# Altium project Gesturelink.PrjPcb (part 1 of 4)
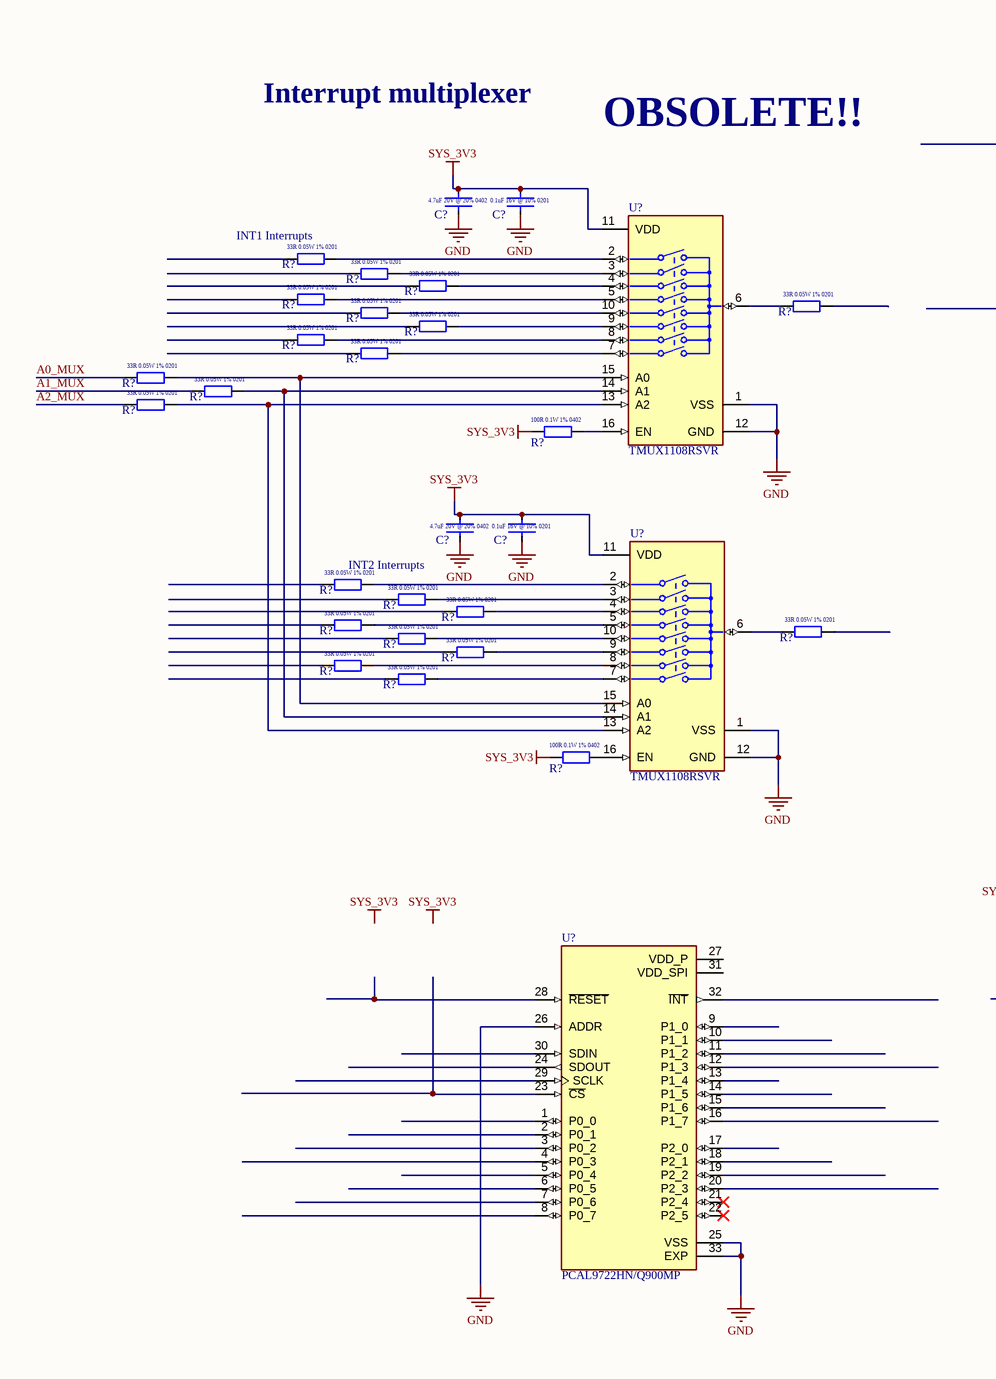
[diagram p0: Translate to rigid Flex gesture recognition.SchDoc, left]
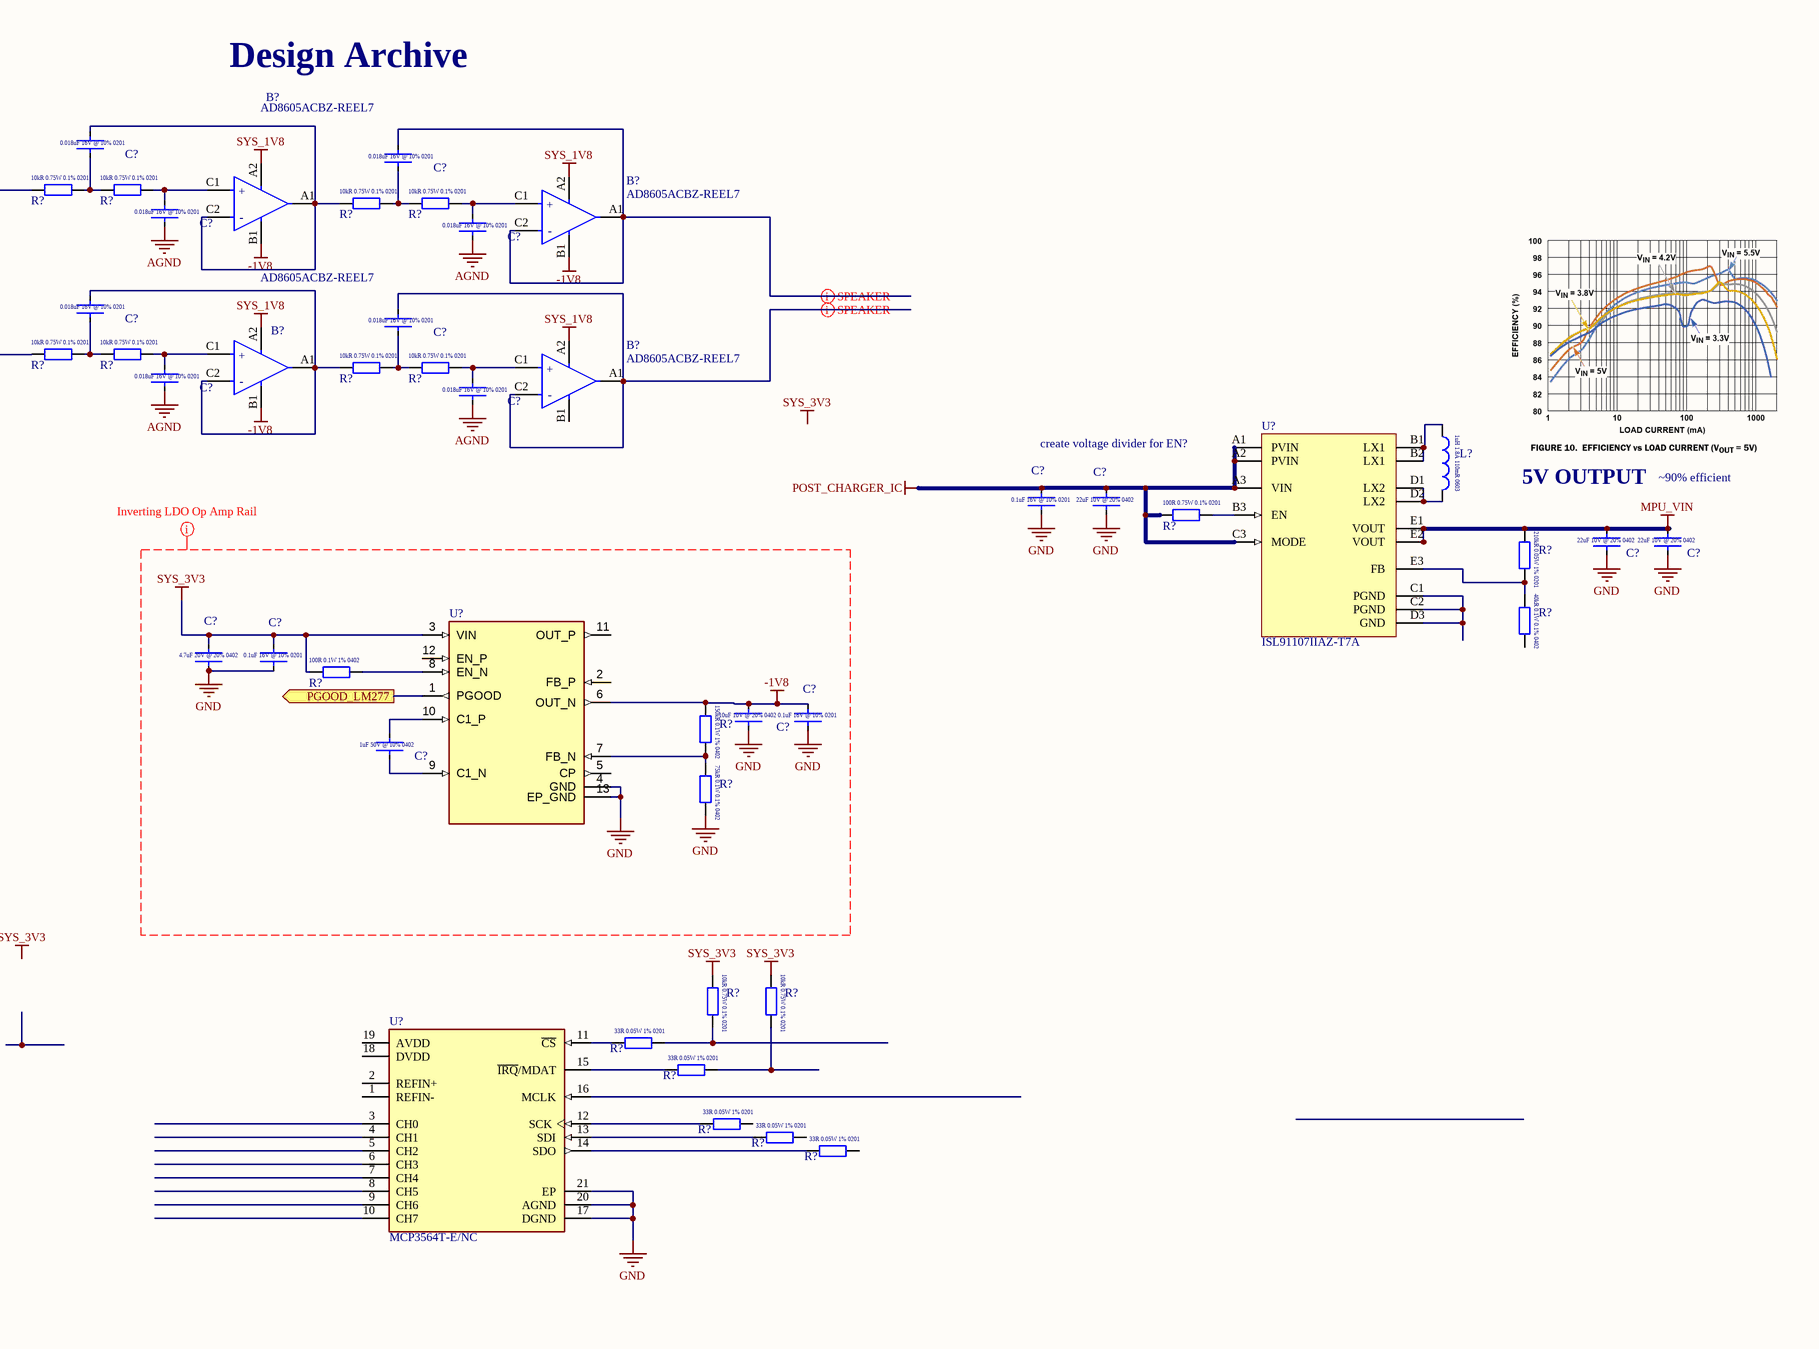
[diagram p1: Translate to rigid Flex gesture recognition.SchDoc, right]
16 sheets, 583 parts. Net scope: hierarchical (ports join the sheet entries above them; power ports are global).
Board files: Gesturelink V1.PcbDoc, Simulation outbound.PcbDoc
Sheets:
  Translate to rigid Flex gesture recognition.SchDoc
  Main Page.SchDoc
    U_CPU_DDR = CPU_DDR.SchDoc
    U_LPDDR4 = LPDDR4.SchDoc
    U_Power Management = Power Management.SchDoc
    U_CPU_Peripherals = CPU_Peripherals.SchDoc
    U_eMMC Memory = eMMC Memory.SchDoc
    U_WIFI and BLE = WIFI and BLE.SchDoc
    U_Display = Display.SchDoc
    U_Connector B = Connector B.SchDoc
    U_CPU_power = CPU_power.SchDoc
    U_Audio = Audio.SchDoc
    U_External Power Connectors = External Power Connectors.SchDoc
    U_IMU Gesture Recognition Sensors = IMU Gesture Recognition Sensors.SchDoc
    U_Transport Layer Security = Transport Layer Security.SchDoc
    U_Connector A = Connector A.SchDoc

## Sheet Translate to rigid Flex gesture recognition.SchDoc
size 594 x 420 mm; SheetNumber: 1; SheetTotal: 16; SPICEModelCacheRCYREFEF: <root> / <DocumentId>RCYREFEF</DocumentId> / <CacheFrame Number="0"> / <Model Name="switch_array_u_sw_array_s11" Kind="CKT"> / <Text>*$ / .subckt SWITCH_ARRAY_U_SW_ARRAY_S11 1 2 3 4 / S_U_SW_ARRAY_S11         3 4 1 2 _U_SW_ARRAY_S11 / RS_U_SW_ARRAY_S11         1 2 1G / .MODEL         _U_SW_ARRAY_S11 VSWITCH Roff=1e12 Ron=300m Voff=0.2V Von=0.8V / .ends SWITCH_ARRAY_U_SW_ARRAY_S11</Text> / </Model> / </CacheFrame> / </root>

### Parts
(Parts that share a designator on the sheet are numbered #1, #2 ... from top to bottom, then left to right.)
B?#1  AD8605ACBZ-REEL7  [FP-CB-5-1-MFG]
B?#2  AD8605ACBZ-REEL7  [FP-CB-5-1-MFG]
B?#3  AD8605ACBZ-REEL7  [FP-CB-5-1-MFG]
B?#4  AD8605ACBZ-REEL7  [FP-CB-5-1-MFG]
C?#1  GRM033R61C183KE84D  [CAPC0603X03L]  (value not drawn)
C?#2  GRM033R61C183KE84D  [CAPC0603X03L]  (value not drawn)
C?#3  GRM033R61C183KE84D  [CAPC0603X03L]  (value not drawn)
C?#4  GRM033R61C183KE84D  [CAPC0603X03L]  (value not drawn)
C?#5  4.7uF  [CAPC1005X06L]  (value not drawn)
C?#6  0.1uF  [CAPC0603X03L]  (value not drawn)
C?#7  GRM033R61C183KE84D  [CAPC0603X03L]  (value not drawn)
C?#8  GRM033R61C183KE84D  [CAPC0603X03L]  (value not drawn)
C?#9  GRM033R61C183KE84D  [CAPC0603X03L]  (value not drawn)
C?#10  GRM033R61C183KE84D  [CAPC0603X03L]  (value not drawn)
C?#11  0.1uF  [CAPC0603X03L]  (value not drawn)
C?#12  GRM158R61A226ME15D  [CAPC1005X06L]  (value not drawn)
C?#13  GRM158R61A226ME15D  [CAPC1005X06L]  (value not drawn)
C?#14  GRM158R61A226ME15D  [CAPC1005X06L]  (value not drawn)
C?#15  4.7uF  [CAPC1005X06L]  (value not drawn)
C?#16  0.1uF  [CAPC0603X03L]  (value not drawn)
C?#17  4.7uF  [CAPC1005X06L]  (value not drawn)
C?#18  0.1uF  [CAPC0603X03L]  (value not drawn)
C?#19  GRT155R61A106ME13J  [CAPC1005X06L]  (value not drawn)
C?#20  0.1uF  [CAPC0603X03L]  (value not drawn)
C?#21  GRM155R61H105KE05D  [CAPC1005X06L]  (value not drawn)
L?  IHHP0603ZHER1R0M01  [INDC1608LPX08L]  (value not drawn)
R?#1  TNPW020110K0BEED  [RESC0603X03N]  (value not drawn)
R?#2  TNPW020110K0BEED  [RESC0603X03N]  (value not drawn)
R?#3  TNPW020110K0BEED  [RESC0603X03N]  (value not drawn)
R?#4  TNPW020110K0BEED  [RESC0603X03N]  (value not drawn)
R?#5  ERJ-1GNF33R0C  [RESC0603X03L]  (value not drawn)
R?#6  ERJ-1GNF33R0C  [RESC0603X03L]  (value not drawn)
R?#7  ERJ-1GNF33R0C  [RESC0603X03L]  (value not drawn)
R?#8  ERJ-1GNF33R0C  [RESC0603X03L]  (value not drawn)
R?#9  ERJ-1GNF33R0C  [RESC0603X03L]  (value not drawn)
R?#10  TNPW020110K0BEED  [RESC0603X03N]  (value not drawn)
R?#11  TNPW020110K0BEED  [RESC0603X03N]  (value not drawn)
R?#12  ERJ-1GNF33R0C  [RESC0603X03L]  (value not drawn)
R?#13  TNPW020110K0BEED  [RESC0603X03N]  (value not drawn)
R?#14  TNPW020110K0BEED  [RESC0603X03N]  (value not drawn)
R?#15  ERJ-1GNF33R0C  [RESC0603X03L]  (value not drawn)
R?#16  ERJ-1GNF33R0C  [RESC0603X03L]  (value not drawn)
R?#17  ERJ-1GNF33R0C  [RESC0603X03L]  (value not drawn)
R?#18  ERJ-1GNF33R0C  [RESC0603X03L]  (value not drawn)
R?#19  ERJ-1GNF33R0C  [RESC0603X03L]  (value not drawn)
R?#20  ERJ-1GNF33R0C  [RESC0603X03L]  (value not drawn)
R?#21  ERJ-2RKF1000X  [RESC1005X04L]  (value not drawn)
R?#22  TNPW0201100RBEED  [RESC0603X03L]  (value not drawn)
R?#23  ERJ-1GNF2103C  [RESC0603X03L]  (value not drawn)
R?#24  RNCF0402BTE40K0  [RESC1005X04L]  (value not drawn)
R?#25  ERJ-1GNF33R0C  [RESC0603X03L]  (value not drawn)
R?#26  ERJ-1GNF33R0C  [RESC0603X03L]  (value not drawn)
R?#27  ERJ-1GNF33R0C  [RESC0603X03L]  (value not drawn)
R?#28  ERJ-1GNF33R0C  [RESC0603X03L]  (value not drawn)
R?#29  ERJ-2RKF1000X  [RESC1005X04L]  (value not drawn)
R?#30  ERJ-1GNF33R0C  [RESC0603X03L]  (value not drawn)
R?#31  ERJ-1GNF33R0C  [RESC0603X03L]  (value not drawn)
R?#32  ERJ-1GNF33R0C  [RESC0603X03L]  (value not drawn)
R?#33  ERJ-1GNF33R0C  [RESC0603X03L]  (value not drawn)
R?#34  ERJ-1GNF33R0C  [RESC0603X03L]  (value not drawn)
R?#35  RK73H1ETTP1503F  [RESC1005X04L]  (value not drawn)
R?#36  RP73PF1E75KBTD  [RESC1005X04L]  (value not drawn)
R?#37  ERJ-2RKF1000X  [RESC1005X04L]  (value not drawn)
R?#38  TNPW020110K0BEED  [RESC0603X03N]  (value not drawn)
R?#39  TNPW020110K0BEED  [RESC0603X03N]  (value not drawn)
R?#40  ERJ-1GNF33R0C  [RESC0603X03L]  (value not drawn)
R?#41  ERJ-1GNF33R0C  [RESC0603X03L]  (value not drawn)
R?#42  ERJ-1GNF33R0C  [RESC0603X03L]  (value not drawn)
R?#43  ERJ-1GNF33R0C  [RESC0603X03L]  (value not drawn)
R?#44  ERJ-1GNF33R0C  [RESC0603X03L]  (value not drawn)
U?#1  TMUX1108RSVR  [FP-RSV0016A-MFG]
U?#2  ISL91107IIAZ-T7A  [W3x5_15_MFG]
U?#3  TMUX1108RSVR  [FP-RSV0016A-MFG]
U?#4  LM27762DSST  [VREG_LM27762DSSR]  (value not drawn)
U?#5  MCP3564T-E/NC  [FP-C04-264-IPC_B]
U?#6  PCAL9722HN/Q900MP  [IC_PCAL9722HN/Q900MP]

### Ports
PGOOD_LM277 (out, see Main Page[3B])

### Nets
-1V8: B?#1.B1(V-) B?#2.B1(V-) B?#3.B1(V-) C?#19.2 C?#20.2 R?#35.1 U?#4.6(OUT_N)
AGND: C?#3.1 C?#4.1 C?#9.1 C?#10.1
GND: C?#5.1 C?#6.1 C?#11.1 C?#12.1 C?#13.1 C?#14.1 C?#15.1 C?#16.1 C?#17.1 C?#18.1 C?#19.1 C?#20.1 R?#36.2 U?#1.1(VSS) U?#1.12(GND) U?#3.1(VSS) U?#3.12(GND) U?#4.4(GND) U?#4.13(EP_GND) U?#5.17(DGND) U?#5.20(AGND) U?#5.21(EP) U?#6.25(VSS) U?#6.26(ADDR) U?#6.33(EXP)
MPU_VIN: C?#13.2 C?#14.2 R?#23.1 U?#2.E1(VOUT) U?#2.E2(VOUT)
POST_CHARGER_IC: C?#11.2 C?#12.2 R?#22.1 U?#2.A1(PVIN) U?#2.A2(PVIN) U?#2.A3(VIN) U?#2.C3(MODE)
SYS_1V8: B?#1.A2(V+) B?#2.A2(V+) B?#3.A2(V+) B?#4.A2(V+)
SYS_3V3: C?#5.2 C?#6.2 C?#15.2 C?#16.2 C?#17.2 C?#18.2 R?#21.1 R?#29.1 R?#37.1 R?#38.1 R?#39.1 U?#1.11(VDD) U?#3.11(VDD) U?#4.3(VIN)
A0_MUX: R?#18.1
A1_MUX: R?#19.1
A2_MUX: R?#20.1
NetB?#1_A1: B?#1.A1(OUT) B?#1.C2(-IN) C?#1.2 R?#3.1
NetB?#1_C1: B?#1.C1(+IN) C?#3.2 R?#2.2
NetB?#2_A1: B?#2.A1(OUT) B?#2.C2(-IN) C?#2.2
NetB?#2_C1: B?#2.C1(+IN) C?#4.2 R?#4.2
NetB?#3_A1: B?#3.A1(OUT) B?#3.C2(-IN) C?#7.2 R?#13.1
NetB?#3_C1: B?#3.C1(+IN) C?#9.2 R?#11.2
NetB?#4_A1: B?#4.A1(OUT) B?#4.C2(-IN) C?#8.2
NetB?#4_C1: B?#4.C1(+IN) C?#10.2 R?#14.2
NetC?#1_1: C?#1.1 R?#1.2 R?#2.1
NetC?#2_1: C?#2.1 R?#3.2 R?#4.1
NetC?#7_1: C?#7.1 R?#10.2 R?#11.1
NetC?#8_1: C?#8.1 R?#13.2 R?#14.1
NetC?#21_1: C?#21.1 U?#4.9(C1_N)
NetC?#21_2: C?#21.2 U?#4.10(C1_P)
NetL?_1: L?.1 U?#2.B1(LX1) U?#2.B2(LX1)
NetL?_2: L?.2 U?#2.D1(LX2) U?#2.D2(LX2)
NetR?#5_2: R?#5.2 U?#1.2(S1)
NetR?#6_2: R?#6.2 U?#1.3(S2)
NetR?#7_2: R?#7.2 U?#1.4(S3)
NetR?#8_2: R?#8.2 U?#1.5(S4)
NetR?#9_1: R?#9.1 U?#1.6(D)
NetR?#12_2: R?#12.2 U?#1.10(S5)
NetR?#15_2: R?#15.2 U?#1.9(S6)
NetR?#16_2: R?#16.2 U?#1.8(S7)
NetR?#17_2: R?#17.2 U?#1.7(S8)
NetR?#18_2: R?#18.2 U?#1.15(A0) U?#3.15(A0)
NetR?#19_2: R?#19.2 U?#1.14(A1) U?#3.14(A1)
NetR?#20_2: R?#20.2 U?#1.13(A2) U?#3.13(A2)
NetR?#21_2: R?#21.2 U?#1.16(EN)
NetR?#22_2: R?#22.2 U?#2.B3(EN)
NetR?#23_2: R?#23.2 R?#24.1 U?#2.E3(FB)
NetR?#25_2: R?#25.2 U?#3.2(S1)
NetR?#26_2: R?#26.2 U?#3.3(S2)
NetR?#27_2: R?#27.2 U?#3.4(S3)
NetR?#28_2: R?#28.2 U?#3.5(S4)
NetR?#29_2: R?#29.2 U?#4.8(EN_N)
NetR?#30_1: R?#30.1 U?#3.6(D)
NetR?#31_2: R?#31.2 U?#3.10(S5)
NetR?#32_2: R?#32.2 U?#3.9(S6)
NetR?#33_2: R?#33.2 U?#3.8(S7)
NetR?#34_2: R?#34.2 U?#3.7(S8)
NetR?#35_2: R?#35.2 R?#36.1 U?#4.7(FB_N)
NetR?#37_2: R?#37.2 U?#3.16(EN)
NetR?#38_2: R?#38.2 R?#40.2
NetR?#39_2: R?#39.2 R?#41.2
NetR?#40_1: R?#40.1 U?#5.11(~{CS})
NetR?#41_1: R?#41.1 U?#5.15(~{IRQ}/MDAT)
NetR?#42_1: R?#42.1 U?#5.12(SCK)
NetR?#43_1: R?#43.1 U?#5.13(SDI)
NetR?#44_1: R?#44.1 U?#5.14(SDO)
NetU?#2_C1: U?#2.C1(PGND) U?#2.C2(PGND) U?#2.D3(GND)
NetU?#4_1: U?#4.1(PGOOD) ; port PGOOD_LM277

Not connected (* = marked no-connect by the designer): B?#4 B1(V-); R?#1 1; R?#5 1; R?#6 1; R?#7 1; R?#8 1; R?#9 2; R?#10 1; R?#12 1; R?#15 1; R?#16 1; R?#17 1; R?#24 2; R?#25 1; R?#26 1; R?#27 1; R?#28 1; R?#30 2; R?#31 1; R?#32 1; R?#33 1; R?#34 1; R?#42 2; R?#43 2; R?#44 2; U?#4 2(FB_P) 5(CP) 11(OUT_P) 12(EN_P); U?#5 1(REFIN-) 2(REFIN+) 3(CH0) 4(CH1) 5(CH2) 6(CH3) 7(CH4) 8(CH5) 9(CH6) 10(CH7) 16(MCLK) 18(DVDD) 19(AVDD); U?#6 1(P0_0) 2(P0_1) 3(P0_2) 4(P0_3) 5(P0_4) 6(P0_5) 7(P0_6) 8(P0_7) 9(P1_0) 10(P1_1) 11(P1_2) 12(P1_3) 13(P1_4) 14(P1_5) 15(P1_6) 16(P1_7) 17(P2_0) 18(P2_1) 19(P2_2) 20(P2_3) 21(P2_4)* 22(P2_5)* 23(~{CS}) 24(SDOUT) 27(VDD_P) 28(~{RESET}) 29(SCLK) 30(SDIN) 31(VDD_SPI) 32(~{INT})

### Layout directives
differential pair: NetB?#2_A1, NetB?#4_A1
net class Inverting LDO Op Amp Neg Rail: -1V8, GND, SYS_3V3

### Notes on the sheet
- Design Archive
- Interrupt multiplexer
- OBSOLETE!!
- (near R?#5) INT1 Interrupts
- create voltage divider for EN?
- 5V OUTPUT
- (near C?#14) ~90% efficient
- (near R?#25) INT2 Interrupts
- Labels drawn without touching a wire or pin: SYS_3V3
- DWG NO:
- REV:
- THIS DOCUMENT AND THE DATA DISCLOSED HEREIN OR
- HEREWITH IS THE PROPERTY OF ALTIUM LIMITED AND MAY
- BE FREELY DISTRIBUTED IN WHOLE. NO RIGHTS ARE
- RESERVED OR EXPRESS OR IMPLIED WARANTEE GIVEN.
- REVISION
- DESCRIPTION
- DATE
- APPROVED
- ENG:
- APPROVALS
- PROJECT
- DSN:
- CHK:
- REFERENCE DOCUMENTS
- PROJECT REVISION:
- TITLE
- DOCUMENT REVISION:
- DESIGN ITEM:
- BOM:
- FAB DWG:
- PCB DWG:
- ASSY DWG:
- SCALE:
- A2
- SIZE
- CAGE CODE
- FILE NAME
- DWG NO.
- SHEET
- OF
- REV
- (in symbol CL05A475MO5NUNC) 4.7uF 20V @ 20% 0402
- (in symbol CMP-0384-00007-3) +; -
- (in symbol ERJ-1GNF33R0C) 33R 0.05W 1% 0201
- (in symbol ERJ-1GNF2103C) 210kR 0.05W 1% 0201
- (in symbol ERJ-2RKF1000X) 100R 0.1W 1% 0402
- (in symbol GRM033R61C183KE84D) 0.018uF 16V @ 10% 0201
- (in symbol GRM033R61E104KE14J) 0.1uF 16V @ 10% 0201
- (in symbol GRM155R61H105KE05D) 1uF 50V @ 10% 0402
- (in symbol GRM158R61A226ME15D) 22uF 10V @ 20% 0402
- (in symbol GRT155R61A106ME13J) 10uF 10V @ 20% 0402
- (in symbol IHHP0603ZHER1R0M01) 1uH 1.8A 110mR 0603
- (in symbol RK73H1ETTP1503F) 150kR 0.1W 1% 0402
- (in symbol RNCF0402BTE40K0) 40kR 0.1W 0.1% 0402
- (in symbol RP73PF1E75KBTD) 75kR 0.1W 0.1% 0402
- (in symbol TNPW020110K0BEED) 10kR 0.75W 0.1% 0201
- (in symbol TNPW0201100RBEED) 100R 0.75W 0.1% 0201

### Library data of the parts
B?#1-B?#4 = CMP-0384-00007-3: IC OPAMP GP 1 CIRCUIT 5WLCSP; Gain Bandwidth Product: 10MHz; Common Mode Rejection Ratio: 85dB; Number of Circuits: 1; Operating Supply Current: 1.2mA; Amplifier Type: GENERAL PURPOSE; Input Offset Voltage (Vos): 300uV; Min Supply Voltage: 2.7V; Output Current per Channel: 80mA; Voltage Gain: 120dB; Power Supply Rejection Ratio (PSRR): 95dB; Input Voltage Noise Density: 8nV/sqrt Hz; Input Capacitance: 8.8pF; Slew Rate: 5V/µs; Max Supply Voltage: 5.5V; Input Bias Current: 1pA; Settling Time: 1us; Case/Package: BGA; Package Quantity: 1; Lead Free: Contains Lead; Number of Elements: 1; Min Operating Temperature: -40°C; Number of Amplifiers: 1; Radiation Hardening: No; Max Operating Temperature: 125°C; Unity Gain Bandwidth Product: 10MHz; RoHS Compliant: Yes; Bandwidth: 10MHz; Technology: CMOS; Contact Plating: Copper; REACH SVHC: No SVHC; Number of Pins: 5; Series: DigiTrim®; Packaging: Tape and Reel; Quiescent Current: 1.2mA; Number of Channels: 1
C?#1-C?#4 C?#7-C?#10 = GRM033R61C183KE84D: 0.018 µF ±10% 16V Ceramic Capacitor X5R 0201 (0603 Metric); ComponentLink1Description: New link; ComponentLink1URL: https://www.digikey.com.au/en/products/detail/murata-electronics/GRM033R61C183KE84D/5027499
C?#5 C?#15 C?#17 = CL05A475MO5NUNC: 4.7 µF ±20% 16V Ceramic Capacitor X5R 0402 (1005 Metric)
C?#6 C?#11 C?#16 C?#18 C?#20 = GRM033R61E104KE14J: 0.1 µF ±10% 25V Ceramic Capacitor X5R 0201 (0603 Metric)0.1 µF ±10% 25V Ceramic Capacitor X5R 0201 (0603 Metric); ComponentLink1Description: New link; ComponentLink1URL: https://www.digikey.com.au/en/products/detail/murata-electronics/GRM033R61E104KE14J/4904732?s=N4IgTCBcDaIOICUCyAGAzGhA2AjAURxQBYBpAogKRAF0BfIA
C?#12-C?#14 = GRM158R61A226ME15D: 22uH 0402; ComponentLink1Description: New link; ComponentLink1URL: https://www.digikey.com.au/en/products/detail/murata-electronics/GRM158R61A226ME15D/16033379
C?#19 = GRT155R61A106ME13J: 10 µF ±20% 10V Ceramic Capacitor X5R 0402 (1005 Metric); ComponentLink1Description: New link; ComponentLink1URL: https://www.digikey.com.au/en/products/detail/murata-electronics/GRT155R61A106ME13J/19115510
C?#21 = GRM155R61H105KE05D: 1 µF ±10% 50V Ceramic Capacitor X5R 0402 (1005 Metric); ComponentLink1Description: New link; ComponentLink1URL: https://www.digikey.com.au/en/products/detail/murata-electronics/GRM155R61H105KE05D/13531808
L? = IHHP0603ZHER1R0M01: 1 µH Shielded Inductor 1.8 A 110mOhm Max 0603 (1608 Metric); ComponentLink1Description: New link; ComponentLink1URL: https://www.digikey.com.au/en/products/detail/vishay-dale/IHHP0603ZHER1R0M01/16583528
R?#1-R?#4 R?#10 R?#11 R?#13 R?#14 R?#38 R?#39 = TNPW020110K0BEED: 10 kOhms ±0.1% 0.075W Chip Resistor 0201 (0603 Metric) Anti-Sulfur, Automotive AEC-Q200, Moisture Resistant Thin Film
R?#5-R?#9 R?#12 R?#15-R?#20 R?#25-R?#28 R?#30-R?#34 R?#40-R?#44 = ERJ-1GNF33R0C: 33 Ohms ±1% 0.05W, 1/20W Chip Resistor 0201 (0603 Metric) Thick Film; ComponentLink1Description: New link; ComponentLink1URL: https://www.digikey.com.au/en/products/detail/panasonic-electronic-components/ERJ-1GNF33R0C/2035941
R?#21 R?#29 R?#37 = ERJ-2RKF1000X: 100 Ohms ±1% 0.1W, 1/10W Chip Resistor 0402 (1005 Metric) Automotive AEC-Q200 Thick Film; ComponentLink1Description: New link; ComponentLink1URL: https://www.digikey.com.au/en/products/detail/panasonic-electronic-components/ERJ-2RKF1000X/192080
R?#22 = TNPW0201100RBEED: 100 Ohms ±0.1% 0.075W Chip Resistor 0201 (0603 Metric) Anti-Sulfur, Automotive AEC-Q200, Moisture Resistant Thin Film; Supplier 1: Mouser; Supplier Part Number 1: 71-TNPW0201100RBEED
R?#23 = ERJ-1GNF2103C: 210 kOhms ±1% 0.05W, 1/20W Chip Resistor 0201 (0603 Metric) Thick Film; ComponentLink1Description: New link; ComponentLink1URL: https://www.digikey.com.au/en/products/detail/panasonic-electronic-components/ERJ-1GNF2103C/2036374
R?#24 = RNCF0402BTE40K0: 40 kOhms ±0.1% 0.1W, 1/10W Chip Resistor 0402 (1005 Metric) Automotive AEC-Q200 Thin Film; ComponentLink1Description: New link; ComponentLink1URL: https://www.digikey.com.au/en/products/detail/stackpole-electronics-inc/RNCF0402BTE40K0/6259278
R?#35 = RK73H1ETTP1503F: 150 kOhms ±1% 0.1W, 1/10W Chip Resistor 0402 (1005 Metric) Automotive AEC-Q200 Thick Film; ComponentLink1Description: New link; ComponentLink1URL: https://www.digikey.com/en/products/detail/koa-speer-electronics-inc/RK73H1ETTP1503F/9844093
R?#36 = RP73PF1E75KBTD: 75 kOhms ±0.1% 0.1W, 1/10W Chip Resistor 0402 (1005 Metric) Thin Film; ComponentLink1Description: New link; ComponentLink1URL: https://www.digikey.com/en/products/detail/te-connectivity-passive-product/RP73PF1E75KBTD/8261041
U?#1 U?#3 = CMP-04892-000015-1: IC SWITCH SINGLE 16UQFN; Manufacturer: Texas Instruments; Max Junction Temp: +150°C; Min Supply Voltage: 1.08V; Standoff Height: 0mm; -3Db Bandwith: 90MHz; On State Resistance: 2.5Ω; Nominal Supply Current: 0.008uA; Number Of Circuits: 1; Max Supply Voltage: 5.5V; Digikey Description: IC SWITCH SINGLE 16UQFN; Ambient Temperature Range Low: -40°C; Ambient Temperature Range High: +125°C; ComponentLink2Description: Datasheet; Octopart: https://octopart.com/tmux1108rsvr-texas+instruments-96948107; Temperature Range High: +125°C; Temperature Range Low: -40°C; Height: 0.55mm; RoHS: TRUE; Lead Free: Yes; Automotive: No; Category: IC; Temperature: -40°C to +125°C; Package: RSV0016A; Device Class L2: Interface ICs; ComponentLink2URL: http://www.ti.com/lit/ds/symlink/tmux1108.pdf; Manufacturer Part Number: TMUX1108RSVR; Device Class L3: Multiplexers; Device Class L1: Integrated Circuits (ICs)
U?#2 = CMP-00572-88256049-2: ISL9110 Series 5.5 V 2.5 MHz High Efficiency Buck-Boost Regulator - WLCSP-15; Manufacturer Lifecycle Status: ACTIVE; Quiescent Current: 45µA; Min Supply Voltage: 1.8V; Max Output Current: 2A; Min Output Voltage: 1V; Switching Frequency: 2.5MHz; Max Supply Voltage: 5.5V; Pitch: 400µm; Max Junction Temperature (Tj): 125°C; Efficiency: 96%; Output Voltage: 5.2V; Lead Free: Lead Free; RoHS: Compliant; Number of Pins: 15; ComponentLink1URL: http://www.renesas.com; HelpURL: https://octopart.com/cad-content/api/get-model-datasheet/15189/88256049; ComponentLink1Description: Manufacturer's Website; Lifecycle Status: Production; ComponentLink2URL: https://octopart.com/cad-content/api/get-model-datasheet/15189/88256049; Mount: Surface Mount; ComponentLink3Description: Manufacturer's Package Drawing; Length: 2.1mm; Min Operating Temperature: -40°C; ComponentLink2Description: Datasheet URL; Max Operating Temperature: 85°C; ComponentLink3URL: https://www.renesas.com/en/document/psc/package-drawing-wlcsp-tkcurdl-15pin-w3x515; Height: 500µm; Max Output Voltage: 5.2V; Topology: Buck-Boost; Width: 1.5mm
U?#4 = LM27762DSST: Charge Pump Switching Regulator IC Positive and Negative (Dual Rail) Adjustable -5V, 1.5V 2 - Dual Output 250mA 12-WFDFN Exposed Pad; ComponentLink1Description: New link; ComponentLink1URL: https://www.digikey.com/en/products/detail/texas-instruments/LM27762DSSR/6235195
U?#5 = CMP-06267-000015-1: IC ADC 24BIT SIGMA-DELTA 20UQFN; Number of A/D Converters: 1; Number of Bits: 24; Number of Inputs: 4; Interface: SPI; Sampling Rate: 153600S/s; Max Operating Temperature: 125°C; Series: -; RoHS Compliant: Yes; Min Operating Temperature: -40°C; Mount: Surface Mount
U?#6 = PCAL9722HN/Q900MP: MF: {'manufacturer': u'NXP Semiconductors'}; Package: None; Price: None; Value: *; MP: PCAL9722HN/Q900MP; Availability: Unavailable

## Sheet Main Page.SchDoc
size 420 x 297 mm; SheetNumber: 2; SheetTotal: 16
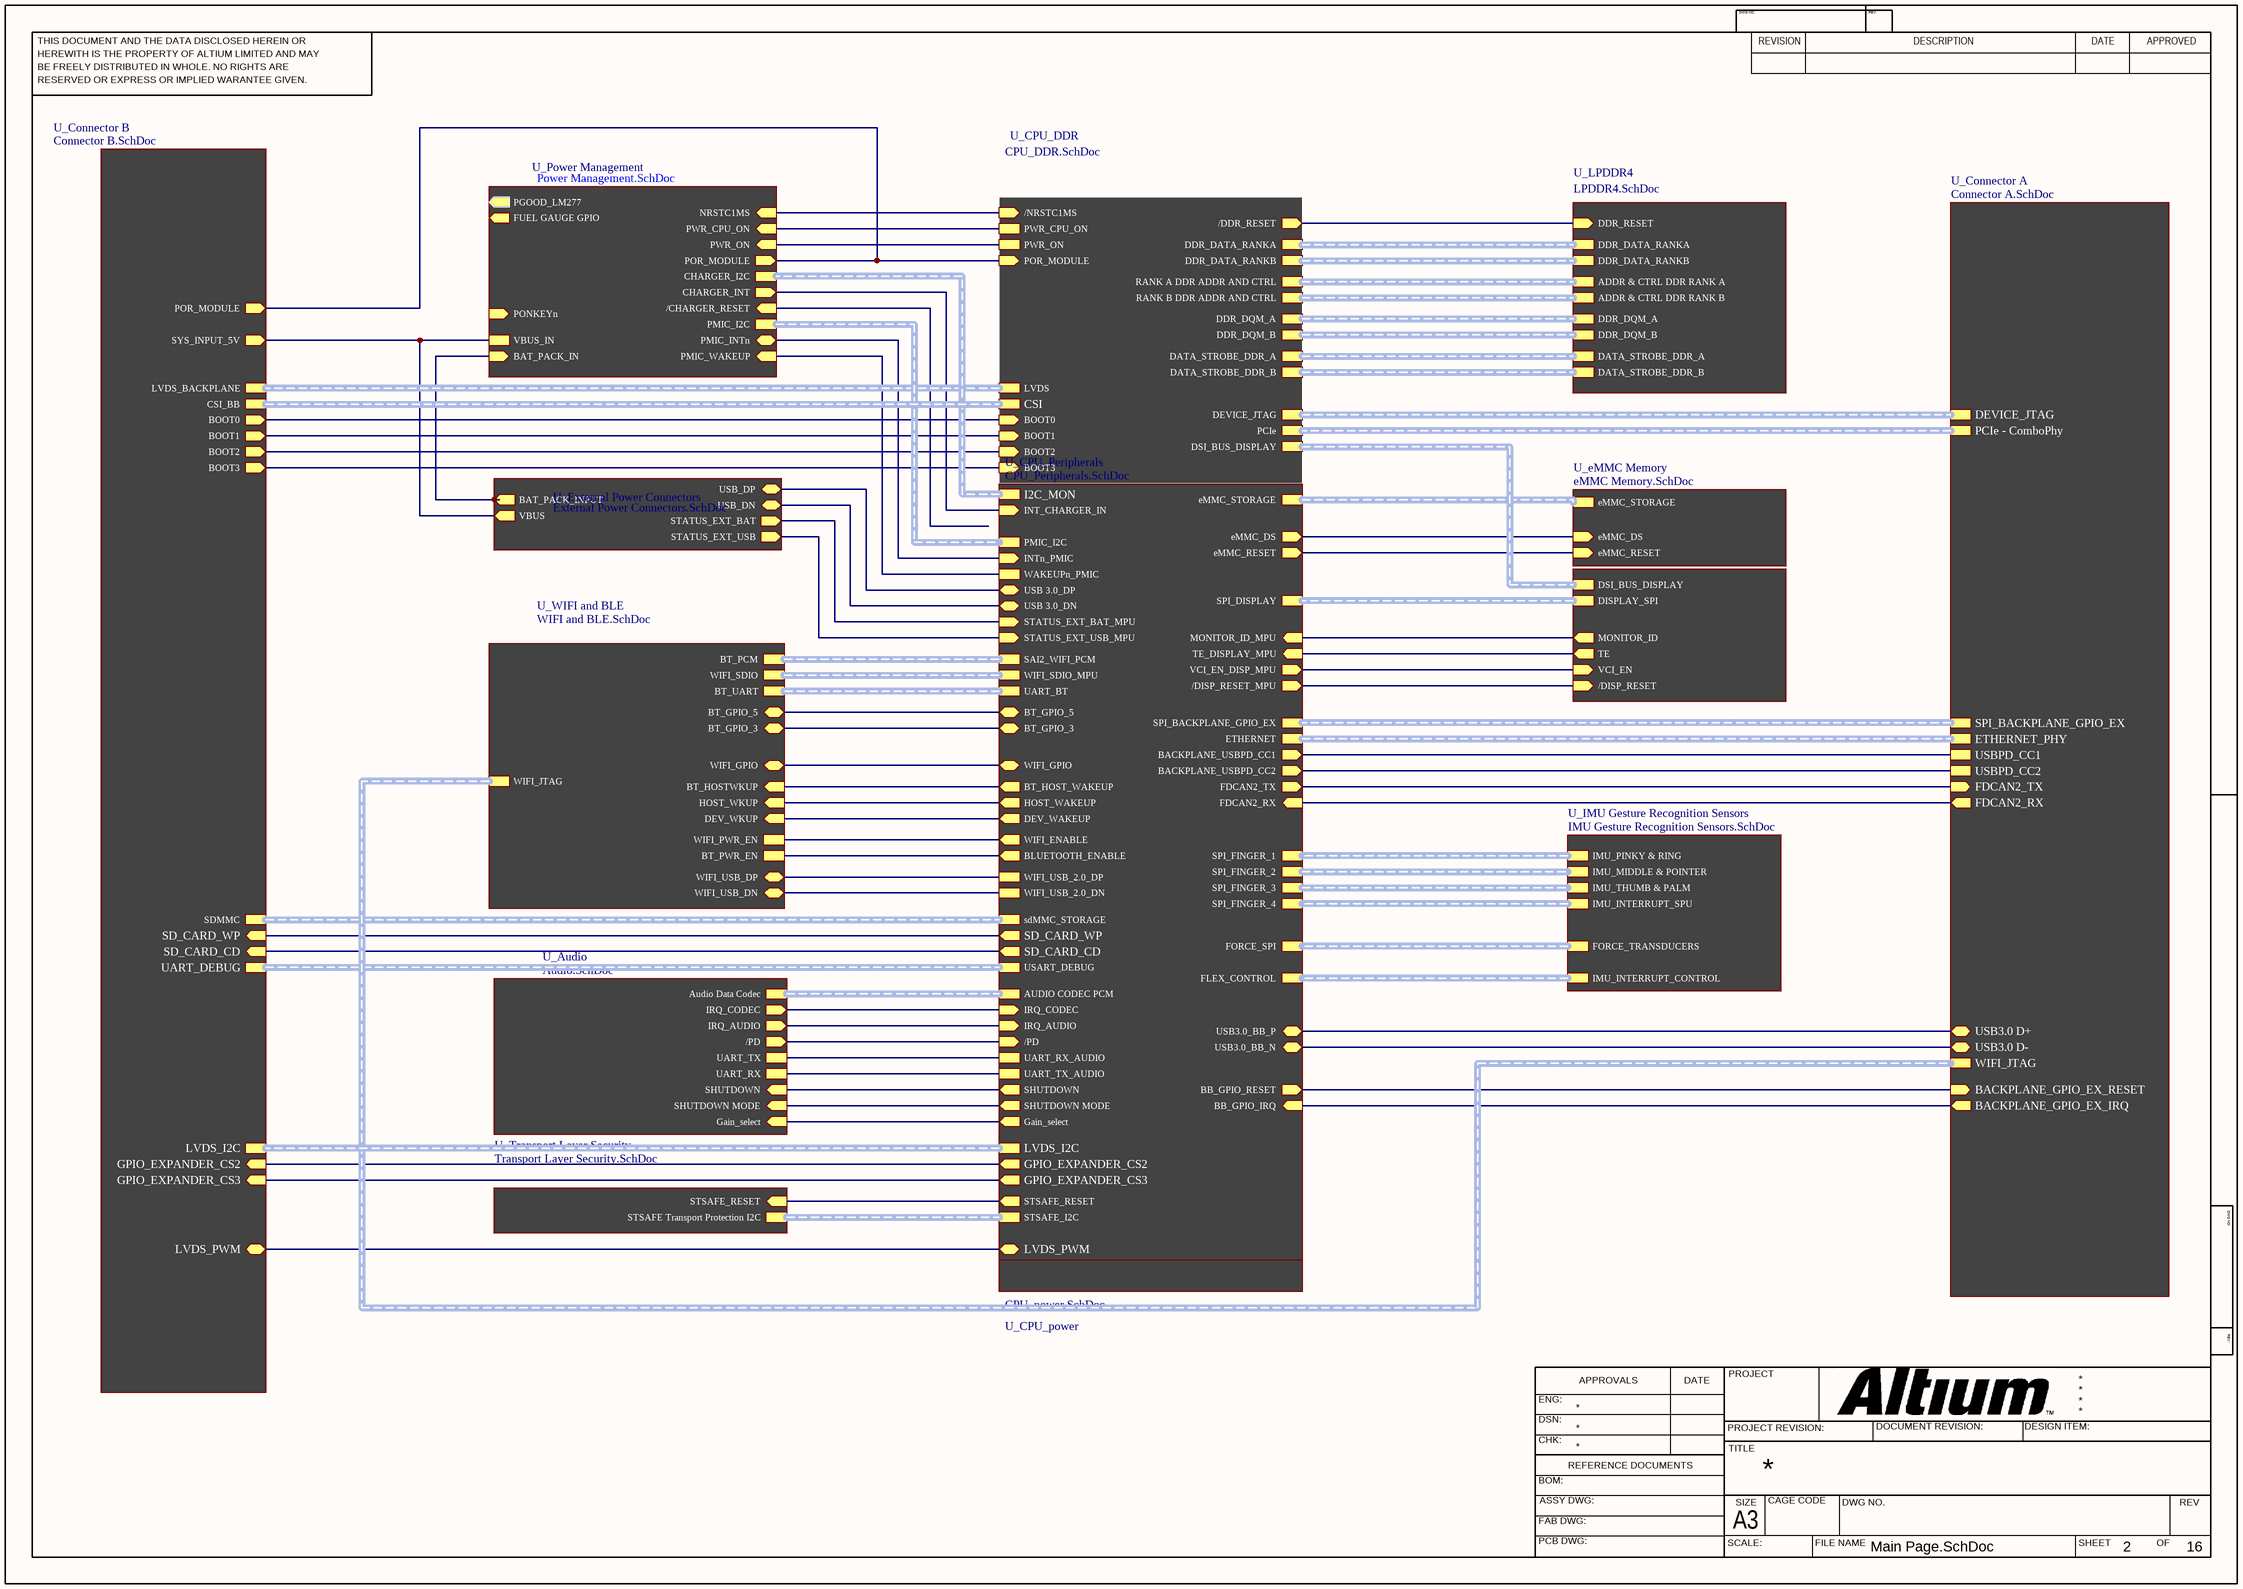
[diagram p2: Main Page.SchDoc]

### Sub-sheets
U_Audio = Audio.SchDoc: UART_TX, UART_RX, Audio Data Codec (harness Audio Data Bus Codec), IRQ_AUDIO (out), SHUTDOWN (in), SHUTDOWN MODE (in), Gain_select (in), /PD (out), IRQ_CODEC (out)
U_Connector A = Connector A.SchDoc: USB3.0 D+ (bidir), USB3.0 D- (bidir), USBPD_CC1, USBPD_CC2, DEVICE_JTAG (harness DEVICE_JTAG), WIFI_JTAG (harness WIFI_JTAG), PCIe - ComboPhy (harness PCIe - ComboPhy), ETHERNET_PHY (harness ETHERNET_PHY), FDCAN2_TX (in), FDCAN2_RX (out), SPI_BACKPLANE_GPIO_EX (harness BACKPLANE_GPIO_EXPANDER_SPI), BACKPLANE_GPIO_EX_RESET (in), BACKPLANE_GPIO_EX_IRQ (out)
U_Connector B = Connector B.SchDoc: SYS_INPUT_5V (out), SDMMC (harness SDMMC), CSI_BB (harness CSI), POR_MODULE (out), BOOT0 (out), BOOT1 (out), BOOT2 (out), BOOT3 (out), LVDS_BACKPLANE, UART_DEBUG (harness UART_DEBUG), SD_CARD_WP (in), SD_CARD_CD (in), LVDS_I2C (harness LVDS_BREAKOUT_I2C), LVDS_PWM (bidir), GPIO_EXPANDER_CS2 (in), GPIO_EXPANDER_CS3 (in)
U_CPU_DDR = CPU_DDR.SchDoc: RANK B DDR ADDR AND CTRL (harness ADDR & CTRL DDR RANK B), RANK A DDR ADDR AND CTRL (harness ADDR & CTRL DDR RANK A), DDR_DATA_RANKB (harness DDR_DATA_RANKB), DDR_DATA_RANKA (harness DDR_DATA_RANKA), /DDR_RESET (out), BOOT0 (in), BOOT1 (in), BOOT2 (in), BOOT3 (in), /NRSTC1MS (in), PWR_CPU_ON, PWR_ON, DSI_BUS_DISPLAY (harness DSI_DISPLAY), PCIe (harness PCIe - ComboPhy), DEVICE_JTAG (harness DEVICE_JTAG), POR_MODULE (in), LVDS (harness LVDS), DDR_DQM_A (harness DDR_DQM_A), DDR_DQM_B (harness DDR_DQM_B), DATA_STROBE_DDR_A (harness DATA_STROBE_DDR_A), DATA_STROBE_DDR_B (harness DATA_STROBE_DDR_B), CSI (harness CSI)
U_CPU_Peripherals = CPU_Peripherals.SchDoc: eMMC_STORAGE (harness eMMC), WIFI_ENABLE (out), BLUETOOTH_ENABLE (out), BT_GPIO_5 (bidir), BT_GPIO_3 (bidir), WIFI_GPIO (bidir), BT_HOST_WAKEUP (out), HOST_WAKEUP (out), DEV_WAKEUP (out), BACKPLANE_USBPD_CC1 (out), BACKPLANE_USBPD_CC2 (out), USB 3.0_DP (bidir), USB 3.0_DN (bidir), sdMMC_STORAGE (harness SDMMC), USART_DEBUG (harness UART_DEBUG), UART_BT (harness UART_BT), ETHERNET (harness ETHERNET_PHY), AUDIO CODEC PCM (harness AUDIO_CODEC_SAI), SPI_FINGER_3 (harness IMU_FINGER3), SPI_FINGER_4 (harness IMU_FINGER4), FORCE_SPI (harness FORCE_TRANSDUCERS), SPI_FINGER_2 (harness IMU_FINGER2), SPI_FINGER_1 (harness IMU_FINGER1), SPI_DISPLAY (harness SPI_DISPLAY), PMIC_I2C (harness I2C_PMIC), WIFI_USB_2.0_DN, WIFI_USB_2.0_DP, FLEX_CONTROL (harness IMU_INTERRUPTS), WAKEUPn_PMIC, INTn_PMIC (in), INT_CHARGER_IN (in), STSAFE_I2C (harness STSAFE Transport Protection I2C), SAI2_WIFI_PCM (harness PCM_WIFI_SAI2), FDCAN2_TX (out), FDCAN2_RX (in), WIFI_SDIO_MPU (harness WIFI_SDIO), IRQ_AUDIO (in), UART_TX_AUDIO, UART_RX_AUDIO, IRQ_CODEC (in), /PD (in), SHUTDOWN (out), SHUTDOWN MODE (out), Gain_select (out), eMMC_DS (out), eMMC_RESET (out), STSAFE_RESET (out), STATUS_EXT_BAT_MPU (in), STATUS_EXT_USB_MPU (in), MONITOR_ID_MPU (in), TE_DISPLAY_MPU (in), VCI_EN_DISP_MPU (out), /DISP_RESET_MPU (out), USB3.0_BB_N (bidir), USB3.0_BB_P (bidir), I2C_MON (harness CHARGER & FUEL GAUGE I2C), SD_CARD_WP (out), SD_CARD_CD (out), LVDS_I2C (harness LVDS_BREAKOUT_I2C), SPI_BACKPLANE_GPIO_EX, BB_GPIO_RESET (out), BB_GPIO_IRQ (in), LVDS_PWM (bidir), GPIO_EXPANDER_CS2 (out), GPIO_EXPANDER_CS3 (out)
U_CPU_power = CPU_power.SchDoc: no entries
U_Display = Display.SchDoc: DSI_BUS_DISPLAY (harness DSI_DISPLAY), MONITOR_ID (out), TE (out), /DISP_RESET (in), VCI_EN (in), DISPLAY_SPI (harness DISPLAY_SPI)
U_eMMC Memory = eMMC Memory.SchDoc: eMMC_STORAGE (harness eMMC), eMMC_DS (in), eMMC_RESET (in)
U_External Power Connectors = External Power Connectors.SchDoc: VBUS (out), USB_DP (bidir), USB_DN (bidir), BAT_PACK_INPUT (out), STATUS_EXT_BAT (out), STATUS_EXT_USB (out)
U_IMU Gesture Recognition Sensors = IMU Gesture Recognition Sensors.SchDoc: IMU_PINKY & RING (harness IMU_FINGER1), IMU_MIDDLE & POINTER (harness IMU_FINGER2), IMU_THUMB & PALM (harness IMU_FINGER3), IMU_INTERRUPT_SPU (harness IMU_FINGER4), FORCE_TRANSDUCERS (harness FORCE_TRANSDUCERS), IMU_INTERRUPT_CONTROL (harness IMU_INTERRUPT_CONTROL)
U_LPDDR4 = LPDDR4.SchDoc: DDR_DATA_RANKB (harness DDR_DATA_RANKB), DDR_DATA_RANKA (harness DDR_DATA_RANKA), ADDR & CTRL DDR RANK A (harness ADDR & CTRL DDR RANK A), ADDR & CTRL DDR RANK B (harness ADDR & CTRL DDR RANK B), DDR_RESET (in), DATA_STROBE_DDR_B (harness DATA_STROBE_DDR), DATA_STROBE_DDR_A (harness DATA_STROBE_DDR), DDR_DQM_B (harness DDR_DQM), DDR_DQM_A (harness DDR_DQM)
U_Power Management = Power Management.SchDoc: PMIC_INTn (bidir), PMIC_WAKEUP (in), PONKEYn (in), PWR_CPU_ON (in), PWR_ON (in), NRSTC1MS (in), PGOOD_LM277 (out), VBUS_IN, CHARGER_INT (out), /CHARGER_RESET (in), BAT_PACK_IN (in), PMIC_I2C (harness PMIC_I2C), POR_MODULE (out), FUEL GAUGE GPIO (out), CHARGER_I2C (harness CHARGER & FUEL GAUGE I2C)
U_Transport Layer Security = Transport Layer Security.SchDoc: STSAFE_RESET (in), STSAFE Transport Protection I2C (harness STSAFE Transport Protection I2C)
U_WIFI and BLE = WIFI and BLE.SchDoc: WIFI_PWR_EN, BT_PWR_EN, BT_PCM (harness BT_PCM), BT_UART (harness BT_UART), BT_GPIO_3 (bidir), BT_GPIO_5 (bidir), BT_HOSTWKUP (in), HOST_WKUP (in), DEV_WKUP (in), WIFI_USB_DP (bidir), WIFI_USB_DN (bidir), WIFI_GPIO (bidir), WIFI_JTAG (harness WIFI_JTAG), WIFI_SDIO (harness WIFI SDIO)

### Nets
BAT_PACK_IN: sheet U_Power Management/BAT_PACK_IN, sheet U_External Power Connectors/BAT_PACK_INPUT
USB_VIN: sheet U_Power Management/VBUS_IN, sheet U_Connector B/SYS_INPUT_5V, sheet U_External Power Connectors/VBUS
/NRST: sheet U_CPU_DDR/POR_MODULE, sheet U_Power Management/POR_MODULE, sheet U_Connector B/POR_MODULE
/NRSTC1MS: sheet U_CPU_DDR//NRSTC1MS, sheet U_Power Management/NRSTC1MS
/PD_CODEC: sheet U_CPU_Peripherals//PD, sheet U_Audio//PD
BB_GPIO_EXTENDER_IRQ: sheet U_CPU_Peripherals/BB_GPIO_IRQ, sheet U_Connector A/BACKPLANE_GPIO_EX_IRQ
BB_GPIO_EXTENDER_R: sheet U_CPU_Peripherals/BB_GPIO_RESET, sheet U_Connector A/BACKPLANE_GPIO_EX_RESET
BKUP_IRQ_CODEC: sheet U_CPU_Peripherals/IRQ_AUDIO, sheet U_Audio/IRQ_AUDIO
BOOT0: sheet U_CPU_DDR/BOOT0, sheet U_Connector B/BOOT0
BOOT1: sheet U_CPU_DDR/BOOT1, sheet U_Connector B/BOOT1
BOOT2: sheet U_CPU_DDR/BOOT2, sheet U_Connector B/BOOT2
BOOT3: sheet U_CPU_DDR/BOOT3, sheet U_Connector B/BOOT3
BT_GPIO_3: sheet U_CPU_Peripherals/BT_GPIO_3, sheet U_WIFI and BLE/BT_GPIO_3
DDR_RESET: sheet U_CPU_DDR//DDR_RESET, sheet U_LPDDR4/DDR_RESET
DISPLAY_RESET: sheet U_CPU_Peripherals//DISP_RESET_MPU, sheet U_Display//DISP_RESET
eMMC_DS_MPU: sheet U_CPU_Peripherals/eMMC_DS, sheet U_eMMC Memory/eMMC_DS
eMMC_RST_MPU: sheet U_CPU_Peripherals/eMMC_RESET, sheet U_eMMC Memory/eMMC_RESET
FDCAN2_RX: sheet U_CPU_Peripherals/FDCAN2_RX, sheet U_Connector A/FDCAN2_RX
FDCAN2_TX: sheet U_CPU_Peripherals/FDCAN2_TX, sheet U_Connector A/FDCAN2_TX
INTn_PMIC: sheet U_Power Management/PMIC_INTn, sheet U_CPU_Peripherals/INTn_PMIC
MAIN_IRQ_CODEC: sheet U_CPU_Peripherals/IRQ_CODEC, sheet U_Audio/IRQ_CODEC
PA_GAIN: sheet U_CPU_Peripherals/Gain_select, sheet U_Audio/Gain_select
PA_SHDN: sheet U_CPU_Peripherals/SHUTDOWN, sheet U_Audio/SHUTDOWN
PA_SHDN_MODE: sheet U_CPU_Peripherals/SHUTDOWN MODE, sheet U_Audio/SHUTDOWN MODE
SD_CARD_CD: sheet U_CPU_Peripherals/SD_CARD_CD, sheet U_Connector B/SD_CARD_CD
SD_CARD_WP: sheet U_CPU_Peripherals/SD_CARD_WP, sheet U_Connector B/SD_CARD_WP
STATUS_EXT_BAT_MPU: sheet U_CPU_Peripherals/STATUS_EXT_BAT_MPU, sheet U_External Power Connectors/STATUS_EXT_BAT
STATUS_EXT_USB_MPU: sheet U_CPU_Peripherals/STATUS_EXT_USB_MPU, sheet U_External Power Connectors/STATUS_EXT_USB
STSAFE_RESET: sheet U_CPU_Peripherals/STSAFE_RESET, sheet U_Transport Layer Security/STSAFE_RESET
TIM20_PWM: sheet U_CPU_Peripherals/LVDS_PWM, sheet U_Connector B/LVDS_PWM
UART5_RX: sheet U_CPU_Peripherals/UART_TX_AUDIO, sheet U_Audio/UART_RX
UART5_TX: sheet U_CPU_Peripherals/UART_RX_AUDIO, sheet U_Audio/UART_TX
USB3.0_BB_N: sheet U_CPU_Peripherals/USB3.0_BB_N, sheet U_Connector A/USB3.0 D-
USB3.0_BB_P: sheet U_CPU_Peripherals/USB3.0_BB_P, sheet U_Connector A/USB3.0 D+
USB_N: sheet U_CPU_Peripherals/USB 3.0_DN, sheet U_External Power Connectors/USB_DN
USB_P: sheet U_CPU_Peripherals/USB 3.0_DP, sheet U_External Power Connectors/USB_DP
WAKEUPn_PMIC: sheet U_Power Management/PMIC_WAKEUP, sheet U_CPU_Peripherals/WAKEUPn_PMIC
WIFI_USB_N: sheet U_CPU_Peripherals/WIFI_USB_2.0_DN, sheet U_WIFI and BLE/WIFI_USB_DN
WIFI_USB_P: sheet U_CPU_Peripherals/WIFI_USB_2.0_DP, sheet U_WIFI and BLE/WIFI_USB_DP
NetK4_10: sheet U_CPU_Peripherals/BACKPLANE_USBPD_CC2, sheet U_Connector A/USBPD_CC2
NetK4_12: sheet U_CPU_Peripherals/BACKPLANE_USBPD_CC1, sheet U_Connector A/USBPD_CC1
NetK6_2: sheet U_CPU_Peripherals/VCI_EN_DISP_MPU, sheet U_Display/VCI_EN
NetK6_5: sheet U_CPU_Peripherals/TE_DISPLAY_MPU, sheet U_Display/TE
NetK6_17: sheet U_CPU_Peripherals/MONITOR_ID_MPU, sheet U_Display/MONITOR_ID
NetR16_1: sheet U_Power Management/CHARGER_INT, sheet U_CPU_Peripherals/INT_CHARGER_IN
NetR36_1: sheet U_CPU_DDR/PWR_CPU_ON, sheet U_Power Management/PWR_CPU_ON
NetR37_1: sheet U_CPU_DDR/PWR_ON, sheet U_Power Management/PWR_ON
NetR66_2: sheet U_CPU_Peripherals/WIFI_ENABLE, sheet U_WIFI and BLE/WIFI_PWR_EN
NetR67_2: sheet U_CPU_Peripherals/BLUETOOTH_ENABLE, sheet U_WIFI and BLE/BT_PWR_EN
NetR83_1: sheet U_CPU_Peripherals/BT_GPIO_5, sheet U_WIFI and BLE/BT_GPIO_5
NetR90_1: sheet U_CPU_Peripherals/HOST_WAKEUP, sheet U_WIFI and BLE/HOST_WKUP
NetU1_L7: sheet U_CPU_Peripherals/WIFI_GPIO, sheet U_WIFI and BLE/WIFI_GPIO
NetU1_P2: sheet U_CPU_Peripherals/BT_HOST_WAKEUP, sheet U_WIFI and BLE/BT_HOSTWKUP
NetU1_R2: sheet U_CPU_Peripherals/DEV_WAKEUP, sheet U_WIFI and BLE/DEV_WKUP
(unnamed): sheet U_CPU_Peripherals/GPIO_EXPANDER_CS2, sheet U_Connector B/GPIO_EXPANDER_CS2
(unnamed): sheet U_CPU_Peripherals/GPIO_EXPANDER_CS3, sheet U_Connector B/GPIO_EXPANDER_CS3

### Buses and harness runs
harness sheet U_Audio/Audio Data Codec = sheet U_CPU_Peripherals/AUDIO CODEC PCM
harness sheet U_Connector A/DEVICE_JTAG = sheet U_CPU_DDR/DEVICE_JTAG
harness sheet U_Connector A/ETHERNET_PHY = sheet U_CPU_Peripherals/ETHERNET
harness sheet U_Connector A/PCIe - ComboPhy = sheet U_CPU_DDR/PCIe
harness sheet U_Connector A/SPI_BACKPLANE_GPIO_EX = sheet U_CPU_Peripherals/SPI_BACKPLANE_GPIO_EX
harness sheet U_Connector A/WIFI_JTAG = sheet U_WIFI and BLE/WIFI_JTAG
harness sheet U_Connector B/CSI_BB = sheet U_CPU_DDR/CSI
harness sheet U_Connector B/LVDS_BACKPLANE = sheet U_CPU_DDR/LVDS
harness sheet U_Connector B/LVDS_I2C = sheet U_CPU_Peripherals/LVDS_I2C
harness sheet U_Connector B/SDMMC = sheet U_CPU_Peripherals/sdMMC_STORAGE
harness sheet U_Connector B/UART_DEBUG = sheet U_CPU_Peripherals/USART_DEBUG
harness sheet U_CPU_DDR/DATA_STROBE_DDR_A = sheet U_LPDDR4/DATA_STROBE_DDR_A
harness sheet U_CPU_DDR/DATA_STROBE_DDR_B = sheet U_LPDDR4/DATA_STROBE_DDR_B
harness sheet U_CPU_DDR/DDR_DATA_RANKA = sheet U_LPDDR4/DDR_DATA_RANKA
harness sheet U_CPU_DDR/DDR_DATA_RANKB = sheet U_LPDDR4/DDR_DATA_RANKB
harness sheet U_CPU_DDR/DDR_DQM_A = sheet U_LPDDR4/DDR_DQM_A
harness sheet U_CPU_DDR/DDR_DQM_B = sheet U_LPDDR4/DDR_DQM_B
harness sheet U_CPU_DDR/DSI_BUS_DISPLAY = sheet U_Display/DSI_BUS_DISPLAY
harness sheet U_CPU_DDR/RANK A DDR ADDR AND CTRL = sheet U_LPDDR4/ADDR & CTRL DDR RANK A
harness sheet U_CPU_DDR/RANK B DDR ADDR AND CTRL = sheet U_LPDDR4/ADDR & CTRL DDR RANK B
harness sheet U_CPU_Peripherals/eMMC_STORAGE = sheet U_eMMC Memory/eMMC_STORAGE
harness sheet U_CPU_Peripherals/FLEX_CONTROL = sheet U_IMU Gesture Recognition Sensors/IMU_INTERRUPT_CONTROL
harness sheet U_CPU_Peripherals/FORCE_SPI = sheet U_IMU Gesture Recognition Sensors/FORCE_TRANSDUCERS
harness sheet U_CPU_Peripherals/I2C_MON = sheet U_Power Management/CHARGER_I2C
harness sheet U_CPU_Peripherals/PMIC_I2C = sheet U_Power Management/PMIC_I2C
harness sheet U_CPU_Peripherals/SAI2_WIFI_PCM = sheet U_WIFI and BLE/BT_PCM
harness sheet U_CPU_Peripherals/SPI_DISPLAY = sheet U_Display/DISPLAY_SPI
harness sheet U_CPU_Peripherals/SPI_FINGER_1 = sheet U_IMU Gesture Recognition Sensors/IMU_PINKY & RING
harness sheet U_CPU_Peripherals/SPI_FINGER_2 = sheet U_IMU Gesture Recognition Sensors/IMU_MIDDLE & POINTER
harness sheet U_CPU_Peripherals/SPI_FINGER_3 = sheet U_IMU Gesture Recognition Sensors/IMU_THUMB & PALM
harness sheet U_CPU_Peripherals/SPI_FINGER_4 = sheet U_IMU Gesture Recognition Sensors/IMU_INTERRUPT_SPU
harness sheet U_CPU_Peripherals/STSAFE_I2C = sheet U_Transport Layer Security/STSAFE Transport Protection I2C
harness sheet U_CPU_Peripherals/UART_BT = sheet U_WIFI and BLE/BT_UART
harness sheet U_CPU_Peripherals/WIFI_SDIO_MPU = sheet U_WIFI and BLE/WIFI_SDIO

### Notes on the sheet
- THIS DOCUMENT AND THE DATA DISCLOSED HEREIN OR
- HEREWITH IS THE PROPERTY OF ALTIUM LIMITED AND MAY
- DWG NO:
- REVISION
- REV:
- DESCRIPTION
- DATE
- APPROVED
- BE FREELY DISTRIBUTED IN WHOLE. NO RIGHTS ARE
- RESERVED OR EXPRESS OR IMPLIED WARANTEE GIVEN.
- ENG:
- APPROVALS
- PROJECT
- DSN:
- CHK:
- REFERENCE DOCUMENTS
- PROJECT REVISION:
- TITLE
- DOCUMENT REVISION:
- DESIGN ITEM:
- BOM:
- FAB DWG:
- PCB DWG:
- ASSY DWG:
- SCALE:
- A3
- SIZE
- CAGE CODE
- FILE NAME
- DWG NO.
- SHEET
- OF
- REV

## Sheet CPU_DDR.SchDoc
size 594 x 420 mm; SheetNumber: 3; SheetTotal: 16
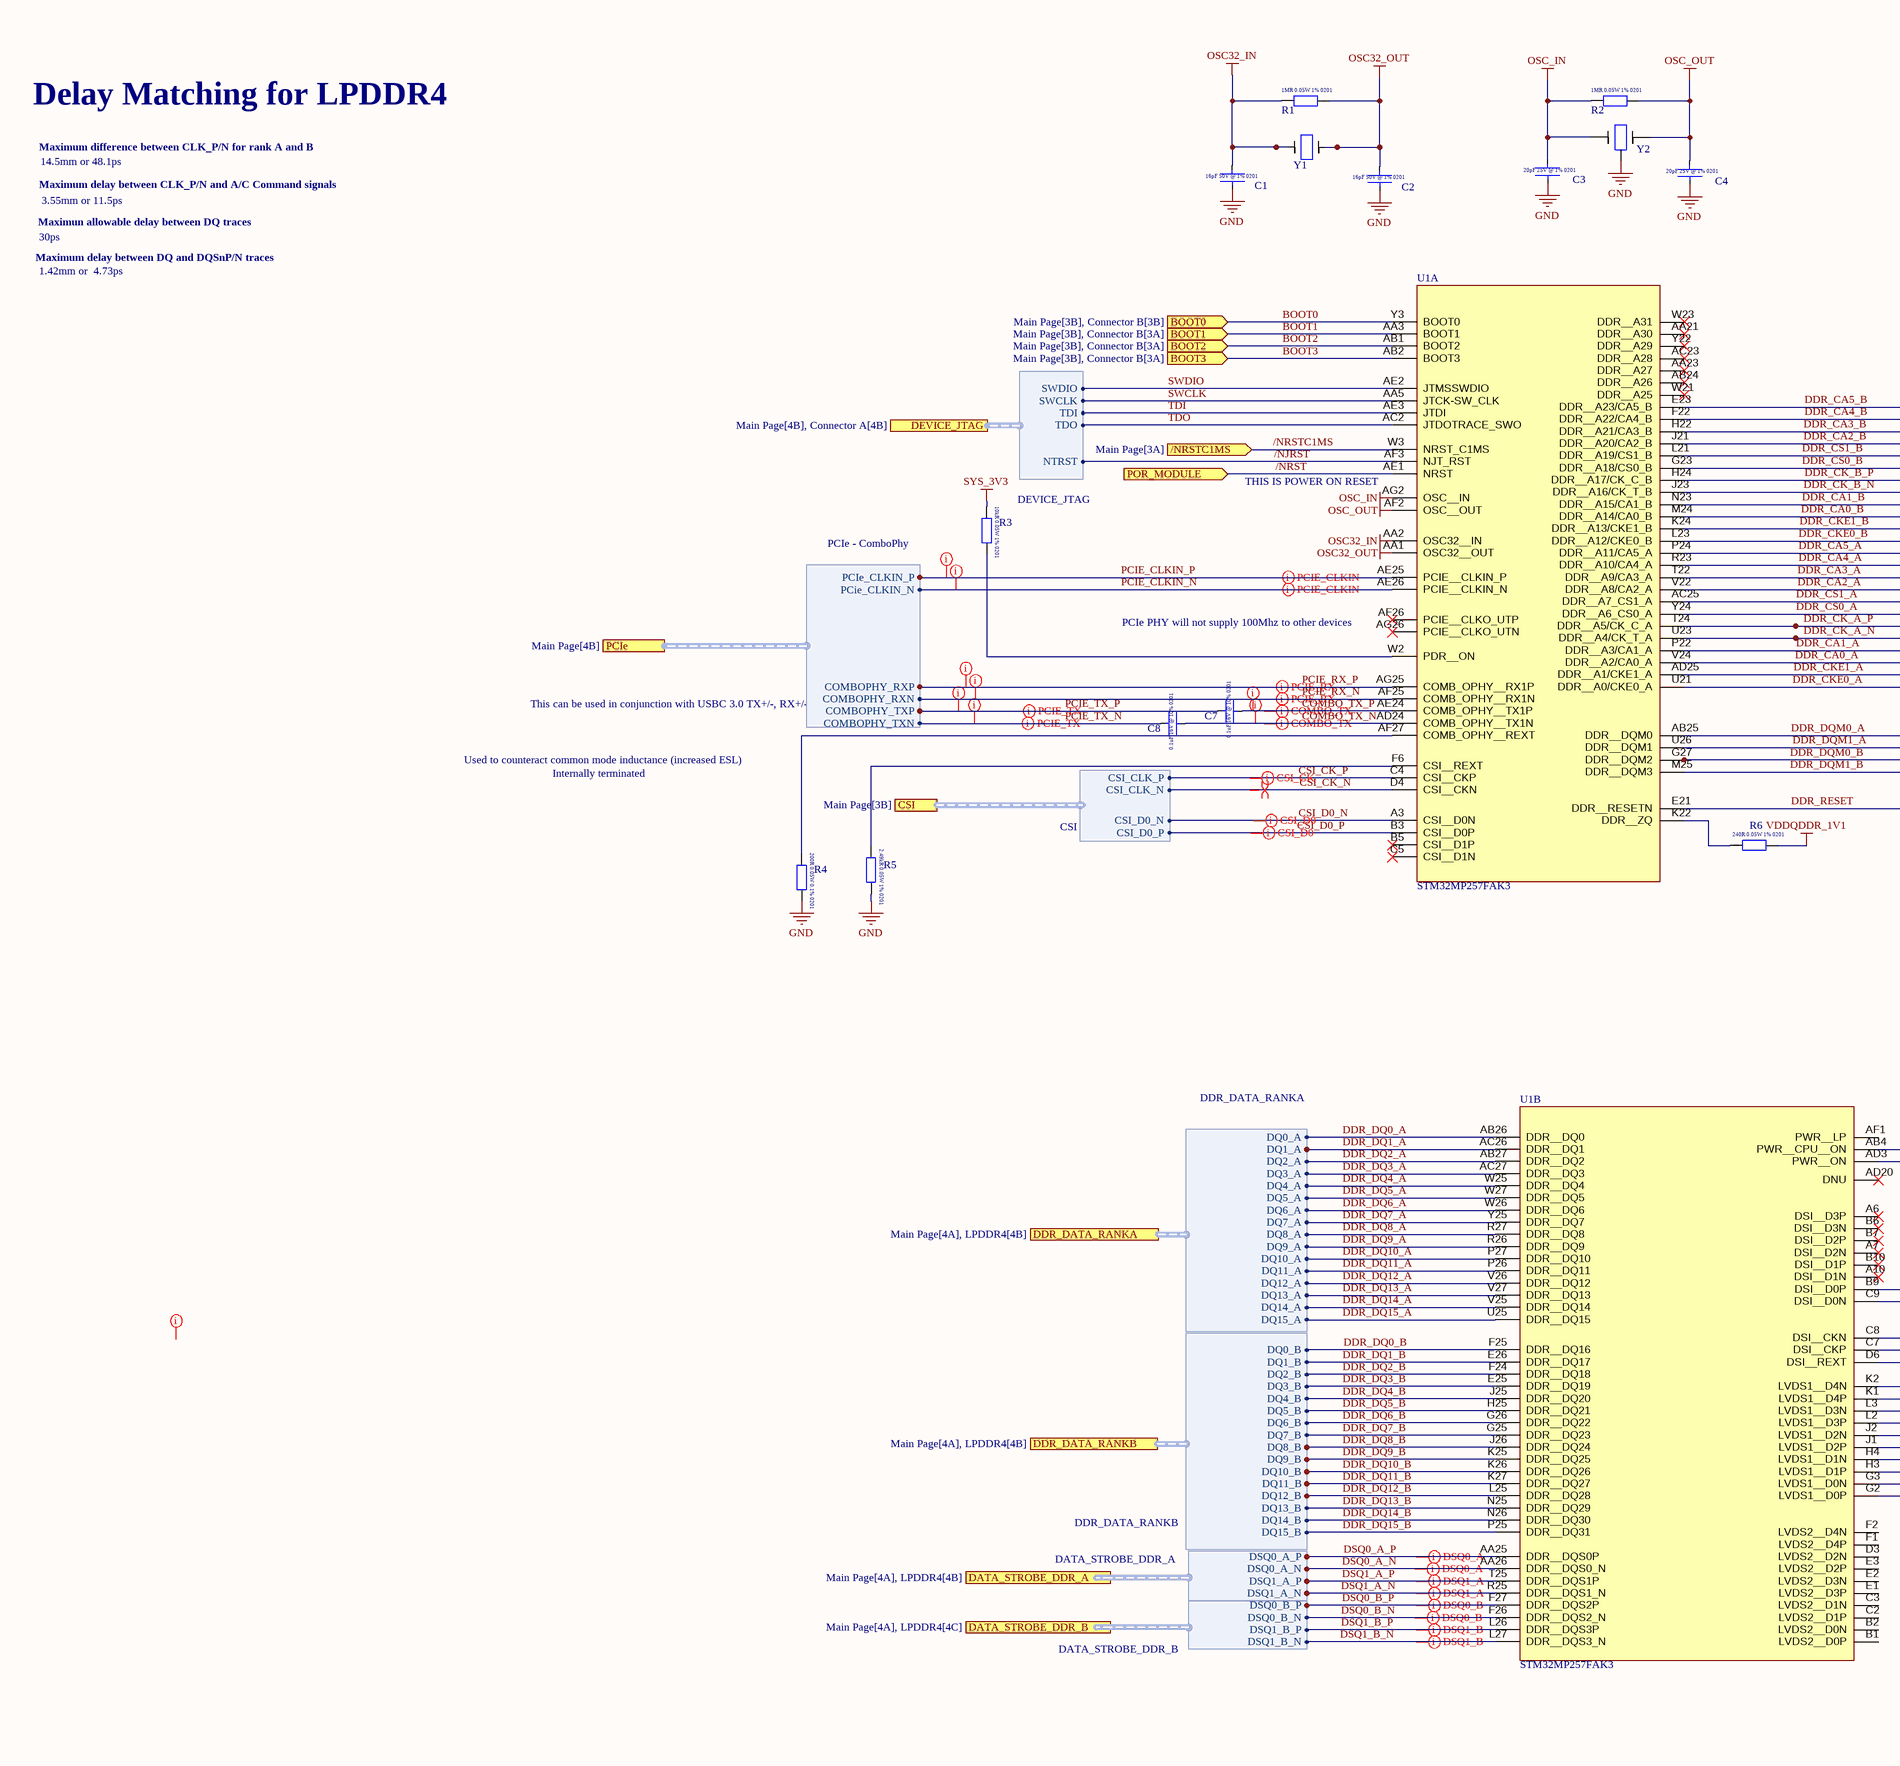
[diagram p3: CPU_DDR.SchDoc, left]
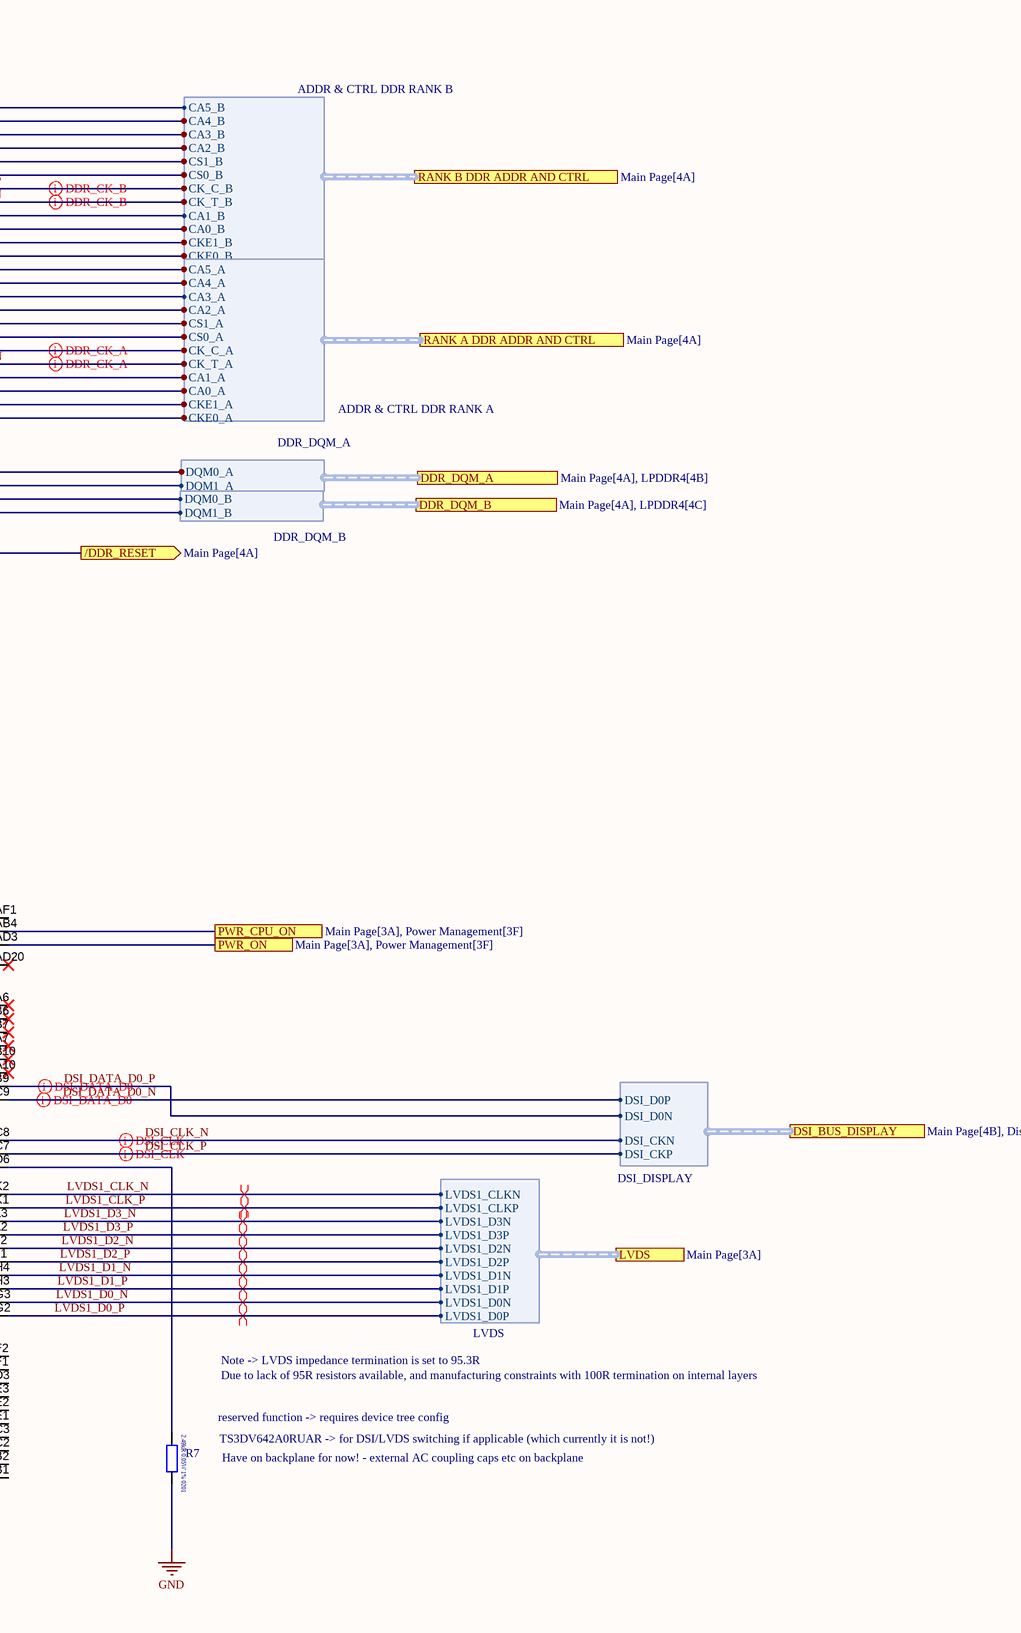
[diagram p4: CPU_DDR.SchDoc, right]

### Parts
C1  GCM0335C1H160FA16D  [CAPC0603X03L]  (value not drawn)
C2  GCM0335C1H160FA16D  [CAPC0603X03L]  (value not drawn)
C3  GJM0335C1E200FB01D  [RESC0603X03L]  (value not drawn)
C4  GJM0335C1E200FB01D  [RESC0603X03L]  (value not drawn)
C7  0.1uF  [CAPC0603X03L]  (value not drawn)
C8  0.1uF  [CAPC0603X03L]  (value not drawn)
R1  ERJ-1GNF1004C  [RESC0603X03N]  (value not drawn)
R2  ERJ-1GNF1004C  [RESC0603X03N]  (value not drawn)
R3  ERJ-1GNF1002C  [RESC0603X03L]  (value not drawn)
R4  ERA-1AEB201C  [RESC0603X03L]  (value not drawn)
R5  ERJ-1GNF2491C  [RESC0603X03L]  (value not drawn)
R6  ERJ-1GNF2400C  [RESC0603X03L]  (value not drawn)
R7  ERJ-1GNF2491C  [RESC0603X03L]  (value not drawn)
U1  STM32MP257FAK3  [STM32MP257FAK3]  (parts A,B of 7)
Y1  CM9V-T1A-32.768KHZ-12.5PF-20PPM-TA-QC  [XTAL_CM9V-T1A-32.768KHZ-12.5PF-20PPM-TA-QC]  (value not drawn)
Y2  FW400WFMT1  [FW400WFMT1]  (value not drawn)

### Ports
/DDR_RESET (out, see Main Page[4A]), /NRSTC1MS (in, see Main Page[3A]), BOOT0 (in, see Main Page[3B], Connector B[3B]), BOOT1 (in, see Main Page[3B], Connector B[3A]), BOOT2 (in, see Main Page[3B], Connector B[3A]), BOOT3 (in, see Main Page[3B], Connector B[3A]), CSI (harness CSI, see Main Page[3B]), DATA_STROBE_DDR_A (harness DATA_STROBE_DDR_A, see Main Page[4A], LPDDR4[4B]), DATA_STROBE_DDR_B (harness DATA_STROBE_DDR_B, see Main Page[4A], LPDDR4[4C]), DDR_DATA_RANKA (harness DDR_DATA_RANKA, see Main Page[4A], LPDDR4[4B]), DDR_DATA_RANKB (harness DDR_DATA_RANKB, see Main Page[4A], LPDDR4[4B]), DDR_DQM_A (harness DDR_DQM_A, see Main Page[4A], LPDDR4[4B]), DDR_DQM_B (harness DDR_DQM_B, see Main Page[4A], LPDDR4[4C]), DEVICE_JTAG (harness DEVICE_JTAG, see Main Page[4B], Connector A[4B]), DSI_BUS_DISPLAY (harness DSI_DISPLAY, see Main Page[4B], Display[1B]), LVDS (harness LVDS, see Main Page[3A]), PCIe (harness PCIe - ComboPhy, see Main Page[4B]), POR_MODULE (in, see Main Page[3A], Connector B[1D], Power Management[3F]), PWR_CPU_ON (see Main Page[3A], Power Management[3F]), PWR_ON (see Main Page[3A], Power Management[3F]), RANK A DDR ADDR AND CTRL (harness ADDR & CTRL DDR RANK A, see Main Page[4A]), RANK B DDR ADDR AND CTRL (harness ADDR & CTRL DDR RANK B, see Main Page[4A])

### Harnesses
ADDR & CTRL DDR RANK B: CA5_B, CA4_B, CA3_B, CA2_B, CS1_B, CS0_B, CK_C_B, CK_T_B, CA1_B, CA0_B, CKE1_B, CKE0_B
ADDR & CTRL DDR RANK A: CA5_A, CA4_A, CA3_A, CA2_A, CS1_A, CS0_A, CK_C_A, CK_T_A, CA1_A, CA0_A, CKE1_A, CKE0_A
DDR_DQM_A: DQM0_A, DQM1_A
DDR_DATA_RANKA: DQ0_A, DQ1_A, DQ2_A, DQ3_A, DQ4_A, DQ5_A, DQ6_A, DQ7_A, DQ8_A, DQ9_A, DQ10_A, DQ11_A, DQ12_A, DQ13_A, DQ14_A, DQ15_A
DDR_DATA_RANKB: DQ0_B, DQ1_B, DQ2_B, DQ3_B, DQ4_B, DQ5_B, DQ6_B, DQ7_B, DQ8_B, DQ9_B, DQ10_B, DQ11_B, DQ12_B, DQ13_B, DQ14_B, DQ15_B
DSI_DISPLAY: DSI_D0P, DSI_D0N, DSI_CKN, DSI_CKP
PCIe - ComboPhy: PCIe_CLKIN_P, PCie_CLKIN_N, COMBOPHY_RXP, COMBOPHY_RXN, COMBOPHY_TXP, COMBOPHY_TXN
DEVICE_JTAG: SWDIO, SWCLK, TDI, TDO, NTRST
LVDS: LVDS1_CLKN, LVDS1_CLKP, LVDS1_D3N, LVDS1_D3P, LVDS1_D2N, LVDS1_D2P, LVDS1_D1N, LVDS1_D1P, LVDS1_D0N, LVDS1_D0P
DDR_DQM_B: DQM0_B, DQM1_B
DATA_STROBE_DDR_A: DSQ0_A_P, DSQ0_A_N, DSQ1_A_P, DSQ1_A_N
DATA_STROBE_DDR_B: DSQ0_B_P, DSQ0_B_N, DSQ1_B_P, DSQ1_B_N
CSI: CSI_CLK_N, CSI_CLK_P, CSI_D0_N, CSI_D0_P

### Nets
GND: C1.1 C2.1 C3.1 C4.1 R4.2 R5.2 R7.2 Y2.4,2
OSC32_IN: C1.2 R1.1 U1.AA2(OSC32__IN) Y1.1
OSC32_OUT: C2.2 R1.2 U1.AA1(OSC32__OUT) Y1.2
OSC_IN: C3.2 R2.1 U1.AG2(OSC__IN) Y2.1
OSC_OUT: C4.2 R2.2 U1.AF2(OSC__OUT) Y2.3
SYS_3V3: R3.1
VDDQDDR_1V1: R6.2
/NJRST: U1.AF3(NJT_RST) ; port DEVICE_JTAG.NTRST
/NRST: U1.AE1(NRST) ; port POR_MODULE
/NRSTC1MS: U1.W3(NRST_C1MS) ; port /NRSTC1MS
BOOT0: U1.Y3(BOOT0) ; port BOOT0
BOOT1: U1.AA3(BOOT1) ; port BOOT1
BOOT2: U1.AB1(BOOT2) ; port BOOT2
BOOT3: U1.AB2(BOOT3) ; port BOOT3
COMBO_TX_N: C8.1 U1.AD24(COMB_OPHY__TX1N)
COMBO_TX_P: C7.1 U1.AE24(COMB_OPHY__TX1P)
CSI_CK_N: U1.D4(CSI__CKN) ; port CSI.CSI_CLK_N
CSI_CK_P: U1.C4(CSI__CKP) ; port CSI.CSI_CLK_P
CSI_D0_N: U1.A3(CSI__D0N) ; port CSI.CSI_D0_N
CSI_D0_P: U1.B3(CSI__D0P) ; port CSI.CSI_D0_P
DDR_CA0_A: U1.V24(DDR__A2/CA0_A) ; port RANK A DDR ADDR AND CTRL.CA0_A
DDR_CA0_B: U1.M24(DDR__A14/CA0_B) ; port RANK B DDR ADDR AND CTRL.CA0_B
DDR_CA1_A: U1.P22(DDR__A3/CA1_A) ; port RANK A DDR ADDR AND CTRL.CA1_A
DDR_CA1_B: U1.N23(DDR__A15/CA1_B) ; port RANK B DDR ADDR AND CTRL.CA1_B
DDR_CA2_A: U1.V22(DDR__A8/CA2_A) ; port RANK A DDR ADDR AND CTRL.CA2_A
DDR_CA2_B: U1.J21(DDR__A20/CA2_B) ; port RANK B DDR ADDR AND CTRL.CA2_B
DDR_CA3_A: U1.T22(DDR__A9/CA3_A) ; port RANK A DDR ADDR AND CTRL.CA3_A
DDR_CA3_B: U1.H22(DDR__A21/CA3_B) ; port RANK B DDR ADDR AND CTRL.CA3_B
DDR_CA4_A: U1.R23(DDR__A10/CA4_A) ; port RANK A DDR ADDR AND CTRL.CA4_A
DDR_CA4_B: U1.F22(DDR__A22/CA4_B) ; port RANK B DDR ADDR AND CTRL.CA4_B
DDR_CA5_A: U1.P24(DDR__A11/CA5_A) ; port RANK A DDR ADDR AND CTRL.CA5_A
DDR_CA5_B: U1.E23(DDR__A23/CA5_B) ; port RANK B DDR ADDR AND CTRL.CA5_B
DDR_CK_A_N: U1.U23(DDR__A4/CK_T_A) ; port RANK A DDR ADDR AND CTRL.CK_T_A
DDR_CK_A_P: U1.T24(DDR__A5/CK_C_A) ; port RANK A DDR ADDR AND CTRL.CK_C_A
DDR_CK_B_N: U1.J23(DDR__A16/CK_T_B) ; port RANK B DDR ADDR AND CTRL.CK_T_B
DDR_CK_B_P: U1.H24(DDR__A17/CK_C_B) ; port RANK B DDR ADDR AND CTRL.CK_C_B
DDR_CKE0_A: U1.U21(DDR__A0/CKE0_A) ; port RANK A DDR ADDR AND CTRL.CKE0_A
DDR_CKE0_B: U1.L23(DDR__A12/CKE0_B) ; port RANK B DDR ADDR AND CTRL.CKE0_B
DDR_CKE1_A: U1.AD25(DDR__A1/CKE1_A) ; port RANK A DDR ADDR AND CTRL.CKE1_A
DDR_CKE1_B: U1.K24(DDR__A13/CKE1_B) ; port RANK B DDR ADDR AND CTRL.CKE1_B
DDR_CS0_A: U1.Y24(DDR__A6_CS0_A) ; port RANK A DDR ADDR AND CTRL.CS0_A
DDR_CS0_B: U1.G23(DDR__A18/CS0_B) ; port RANK B DDR ADDR AND CTRL.CS0_B
DDR_CS1_A: U1.AC25(DDR__A7_CS1_A) ; port RANK A DDR ADDR AND CTRL.CS1_A
DDR_CS1_B: U1.L21(DDR__A19/CS1_B) ; port RANK B DDR ADDR AND CTRL.CS1_B
DDR_DQ0_A: U1.AB26(DDR__DQ0) ; port DDR_DATA_RANKA.DQ0_A
DDR_DQ0_B: U1.F25(DDR__DQ16) ; port DDR_DATA_RANKB.DQ0_B
DDR_DQ1_A: U1.AC26(DDR__DQ1) ; port DDR_DATA_RANKA.DQ1_A
DDR_DQ1_B: U1.E26(DDR__DQ17) ; port DDR_DATA_RANKB.DQ1_B
DDR_DQ2_A: U1.AB27(DDR__DQ2) ; port DDR_DATA_RANKA.DQ2_A
DDR_DQ2_B: U1.F24(DDR__DQ18) ; port DDR_DATA_RANKB.DQ2_B
DDR_DQ3_A: U1.AC27(DDR__DQ3) ; port DDR_DATA_RANKA.DQ3_A
DDR_DQ3_B: U1.E25(DDR__DQ19) ; port DDR_DATA_RANKB.DQ3_B
DDR_DQ4_A: U1.W25(DDR__DQ4) ; port DDR_DATA_RANKA.DQ4_A
DDR_DQ4_B: U1.J25(DDR__DQ20) ; port DDR_DATA_RANKB.DQ4_B
DDR_DQ5_A: U1.W27(DDR__DQ5) ; port DDR_DATA_RANKA.DQ5_A
DDR_DQ5_B: U1.H25(DDR__DQ21) ; port DDR_DATA_RANKB.DQ5_B
DDR_DQ6_A: U1.W26(DDR__DQ6) ; port DDR_DATA_RANKA.DQ6_A
DDR_DQ6_B: U1.G26(DDR__DQ22) ; port DDR_DATA_RANKB.DQ6_B
DDR_DQ7_A: U1.Y25(DDR__DQ7) ; port DDR_DATA_RANKA.DQ7_A
DDR_DQ7_B: U1.G25(DDR__DQ23) ; port DDR_DATA_RANKB.DQ7_B
DDR_DQ8_A: U1.R27(DDR__DQ8) ; port DDR_DATA_RANKA.DQ8_A
DDR_DQ8_B: U1.J26(DDR__DQ24) ; port DDR_DATA_RANKB.DQ8_B
DDR_DQ9_A: U1.R26(DDR__DQ9) ; port DDR_DATA_RANKA.DQ9_A
DDR_DQ9_B: U1.K25(DDR__DQ25) ; port DDR_DATA_RANKB.DQ9_B
DDR_DQ10_A: U1.P27(DDR__DQ10) ; port DDR_DATA_RANKA.DQ10_A
DDR_DQ10_B: U1.K26(DDR__DQ26) ; port DDR_DATA_RANKB.DQ10_B
DDR_DQ11_A: U1.P26(DDR__DQ11) ; port DDR_DATA_RANKA.DQ11_A
DDR_DQ11_B: U1.K27(DDR__DQ27) ; port DDR_DATA_RANKB.DQ11_B
DDR_DQ12_A: U1.V26(DDR__DQ12) ; port DDR_DATA_RANKA.DQ12_A
DDR_DQ12_B: U1.L25(DDR__DQ28) ; port DDR_DATA_RANKB.DQ12_B
DDR_DQ13_A: U1.V27(DDR__DQ13) ; port DDR_DATA_RANKA.DQ13_A
DDR_DQ13_B: U1.N25(DDR__DQ29) ; port DDR_DATA_RANKB.DQ13_B
DDR_DQ14_A: U1.V25(DDR__DQ14) ; port DDR_DATA_RANKA.DQ14_A
DDR_DQ14_B: U1.N26(DDR__DQ30) ; port DDR_DATA_RANKB.DQ14_B
DDR_DQ15_A: U1.U25(DDR__DQ15) ; port DDR_DATA_RANKA.DQ15_A
DDR_DQ15_B: U1.P25(DDR__DQ31) ; port DDR_DATA_RANKB.DQ15_B
DDR_DQM0_A: U1.AB25(DDR__DQM0) ; port DDR_DQM_A.DQM0_A
DDR_DQM0_B: U1.G27(DDR__DQM2) ; port DDR_DQM_B.DQM0_B
DDR_DQM1_A: U1.U26(DDR__DQM1) ; port DDR_DQM_A.DQM1_A
DDR_DQM1_B: U1.M25(DDR__DQM3) ; port DDR_DQM_B.DQM1_B
DDR_RESET: U1.E21(DDR__RESETN) ; port /DDR_RESET
DSI_CLK_N: U1.C8(DSI__CKN) ; port DSI_BUS_DISPLAY.DSI_CKN
DSI_CLK_P: U1.C7(DSI__CKP) ; port DSI_BUS_DISPLAY.DSI_CKP
DSI_DATA_D0_N: U1.C9(DSI__D0N) ; port DSI_BUS_DISPLAY.DSI_D0P
DSI_DATA_D0_P: U1.B9(DSI__D0P) ; port DSI_BUS_DISPLAY.DSI_D0N
DSQ0_A_N: U1.AA26(DDR__DQS0_N) ; port DATA_STROBE_DDR_A.DSQ0_A_N
DSQ0_A_P: U1.AA25(DDR__DQS0P) ; port DATA_STROBE_DDR_A.DSQ0_A_P
DSQ0_B_N: U1.F26(DDR__DQS2_N) ; port DATA_STROBE_DDR_B.DSQ0_B_N
DSQ0_B_P: U1.F27(DDR__DQS2P) ; port DATA_STROBE_DDR_B.DSQ0_B_P
DSQ1_A_N: U1.R25(DDR__DQS1_N) ; port DATA_STROBE_DDR_A.DSQ1_A_N
DSQ1_A_P: U1.T25(DDR__DQS1P) ; port DATA_STROBE_DDR_A.DSQ1_A_P
DSQ1_B_N: U1.L27(DDR__DQS3_N) ; port DATA_STROBE_DDR_B.DSQ1_B_N
DSQ1_B_P: U1.L26(DDR__DQS3P) ; port DATA_STROBE_DDR_B.DSQ1_B_P
LVDS1_CLK_N: U1.K2(LVDS1__D4N) ; port LVDS.LVDS1_CLKN
LVDS1_CLK_P: U1.K1(LVDS1__D4P) ; port LVDS.LVDS1_CLKP
LVDS1_D0_N: U1.G3(LVDS1__D0N) ; port LVDS.LVDS1_D0N
LVDS1_D0_P: U1.G2(LVDS1__D0P) ; port LVDS.LVDS1_D0P
LVDS1_D1_N: U1.H4(LVDS1__D1N) ; port LVDS.LVDS1_D1N
LVDS1_D1_P: U1.H3(LVDS1__D1P) ; port LVDS.LVDS1_D1P
LVDS1_D2_N: U1.J2(LVDS1__D2N) ; port LVDS.LVDS1_D2N
LVDS1_D2_P: U1.J1(LVDS1__D2P) ; port LVDS.LVDS1_D2P
LVDS1_D3_N: U1.L3(LVDS1__D3N) ; port LVDS.LVDS1_D3N
LVDS1_D3_P: U1.L2(LVDS1__D3P) ; port LVDS.LVDS1_D3P
PCIE_CLKIN_N: U1.AE26(PCIE__CLKIN_N) ; port PCIe.PCie_CLKIN_N
PCIE_CLKIN_P: U1.AE25(PCIE__CLKIN_P) ; port PCIe.PCIe_CLKIN_P
PCIE_RX_N: U1.AF25(COMB_OPHY__RX1N) ; port PCIe.COMBOPHY_RXN
PCIE_RX_P: U1.AG25(COMB_OPHY__RX1P) ; port PCIe.COMBOPHY_RXP
PCIE_TX_N: C8.2 ; port PCIe.COMBOPHY_TXN
PCIE_TX_P: C7.2 ; port PCIe.COMBOPHY_TXP
SWCLK: U1.AA5(JTCK-SW_CLK) ; port DEVICE_JTAG.SWCLK
SWDIO: U1.AE2(JTMSSWDIO) ; port DEVICE_JTAG.SWDIO
TDI: U1.AE3(JTDI) ; port DEVICE_JTAG.TDI
TDO: U1.AC2(JTDOTRACE_SWO) ; port DEVICE_JTAG.TDO
NetR3_2: R3.2 U1.W2(PDR__ON)
NetR4_1: R4.1 U1.AF27(COMB_OPHY__REXT)
NetR5_1: R5.1 U1.F6(CSI__REXT)
NetR6_1: R6.1 U1.K22(DDR__ZQ)
NetR7_1: R7.1 U1.D6(DSI__REXT)
NetR36_1: U1.AB4(PWR__CPU__ON) ; port PWR_CPU_ON
NetR37_1: U1.AD3(PWR__ON) ; port PWR_ON

Not connected (* = marked no-connect by the designer): U1 A6(DSI__D3P)* A7(DSI__D2N)* A10(DSI__D1N)* AA21(DDR__A30)* AA23(DDR__A27)* AB24(DDR__A26)* AC23(DDR__A28)* AD20(DNU)* AF1(PWR__LP) AF26(PCIE__CLKO_UTP)* AG26(PCIE__CLKO_UTN)* B1(LVDS2__D0P) B2(LVDS2__D0N) B5(CSI__D1P)* B6(DSI__D3N)* B7(DSI__D2P)* B10(DSI__D1P)* C2(LVDS2__D1P) C3(LVDS2__D1N) C5(CSI__D1N)* D3(LVDS2__D2N) E1(LVDS2__D3P) E2(LVDS2__D3N) E3(LVDS2__D2P) F1(LVDS2__D4P) F2(LVDS2__D4N) W21(DDR__A25)* W23(DDR__A31)* Y22(DDR__A29)*

### Layout directives
differential pair: COMBO_TX_N, COMBO_TX_P, CSI_CK_N, CSI_CK_P, CSI_D0_N, CSI_D0_P, DDR_CK_A_N, DDR_CK_A_P, DDR_CK_B_N, DDR_CK_B_P, DSI_CLK_N, DSI_CLK_P, DSI_DATA_D0_N, DSI_DATA_D0_P, DSQ0_A_N, DSQ0_A_P, DSQ0_B_N, DSQ0_B_P, DSQ1_A_N, DSQ1_A_P, DSQ1_B_N, DSQ1_B_P, LVDS1_CLK_N, LVDS1_CLK_P, LVDS1_D0_N, LVDS1_D0_P, LVDS1_D1_N, LVDS1_D1_P, LVDS1_D2_N, LVDS1_D2_P, LVDS1_D3_N, LVDS1_D3_P, PCIE_CLKIN_N, PCIE_CLKIN_P, PCIE_RX_N, PCIE_RX_P, PCIE_TX_N, PCIE_TX_P
net class High Speed Digital: (no net found under the mark), COMBO_TX_N, COMBO_TX_P, PCIE_CLKIN_N, PCIE_CLKIN_P, PCIE_RX_N, PCIE_RX_P, PCIE_TX_N, PCIE_TX_P

### Notes on the sheet
- Delay Matching for LPDDR4
- Maximum difference between CLK_P/N for rank A and B
- Maximum delay between CLK_P/N and A/C Command signals
- 14.5mm or 48.1ps
- Maximun allowable delay between DQ traces
- 30ps
- 3.55mm or 11.5ps
- Maximum delay between DQ and DQSnP/N traces
- 1.42mm or  4.73ps
- THIS IS POWER ON RESET
- (near U1) PCIe PHY will not supply 100Mhz to other devices
- This can be used in conjunction with USBC 3.0 TX+/-, RX+/-
- Used to counteract common mode inductance (increased ESL)
- Internally terminated
- (near U1) Figure out the PWR_LP situation out
- (near U1) 2.5Gbit each channel
- (near R7) reserved function -> requires device tree config
- Note -> LVDS impedance termination is set to 95.3R
- Due to lack of 95R resistors available, and manufacturing constraints with 100R termination on internal layers
- (near R7) TS3DV642A0RUAR -> for DSI/LVDS switching if applicable (which currently it is not!)
- (near R7) Have on backplane for now! - external AC coupling caps etc on backplane
- DWG NO:
- REV:
- THIS DOCUMENT AND THE DATA DISCLOSED HEREIN OR
- HEREWITH IS THE PROPERTY OF ALTIUM LIMITED AND MAY
- BE FREELY DISTRIBUTED IN WHOLE. NO RIGHTS ARE
- RESERVED OR EXPRESS OR IMPLIED WARANTEE GIVEN.
- REVISION
- DESCRIPTION
- DATE
- APPROVED
- ENG:
- APPROVALS
- PROJECT
- DSN:
- CHK:
- REFERENCE DOCUMENTS
- PROJECT REVISION:
- TITLE
- DOCUMENT REVISION:
- DESIGN ITEM:
- BOM:
- FAB DWG:
- PCB DWG:
- ASSY DWG:
- SCALE:
- A2
- SIZE
- CAGE CODE
- FILE NAME
- DWG NO.
- SHEET
- OF
- REV
- (in symbol ERA-1AEB201C) 200R 0.05W 0.1% 0201
- (in symbol ERJ-1GNF1002C) 10kR 0.05W 1% 0201
- (in symbol ERJ-1GNF1004C) 1MR 0.05W 1% 0201
- (in symbol ERJ-1GNF2400C) 240R 0.05W 1% 0201
- (in symbol ERJ-1GNF2491C) 2.49kR 0.05W 1% 0201
- (in symbol GCM0335C1H160FA16D) 16pF 50V @ 1% 0201
- (in symbol GJM0335C1E200FB01D) 20pF 25V @ 1% 0201
- (in symbol GRM033R61E104KE14J) 0.1uF 16V @ 10% 0201

### Library data of the parts
C1 C2 = GCM0335C1H160FA16D: 16 pF ±1% 50V Ceramic Capacitor C0G, NP0 0201 (0603 Metric); ComponentLink1Description: New link; ComponentLink1URL: https://www.digikey.com.au/en/products/detail/murata-electronics/GCM0335C1H160FA16D/17844782
C3 C4 = GJM0335C1E200FB01D: 20 pF ±1% 25V Ceramic Capacitor C0G, NP0 0201 (0603 Metric); ComponentLink1Description: New link; ComponentLink1URL: https://www.digikey.com.au/en/products/detail/murata-electronics/GJM0335C1E200FB01D/10702837
C7 C8 = GRM033R61E104KE14J: as C?#6 on sheet Translate to rigid Flex gesture recognition; ComponentLink1Description: New link; ComponentLink1URL: https://www.digikey.com.au/en/products/detail/murata-electronics/GRM033R61E104KE14J/4904732?s=N4IgTCBcDaIOICUCyAGAzGhA2AjAURxQBYBpAogKRAF0BfIA
R1 R2 = ERJ-1GNF1004C: 1 MOhms ±1% 0.05W, 1/20W Chip Resistor 0201 (0603 Metric) Thick Film; ComponentLink1Description: New link; ComponentLink1URL: https://www.digikey.com.au/en/products/detail/panasonic-electronic-components/ERJ-1GNF1004C/2036455
R3 = ERJ-1GNF1002C: 10 kOhms ±1% 0.05W, 1/20W Chip Resistor 0201 (0603 Metric) Thick Film; ComponentLink1Description: New link; ComponentLink1URL: https://www.digikey.com.au/en/products/detail/panasonic-electronic-components/ERJ-1GNF1002C/2036226
R4 = ERA-1AEB201C: 200 Ohms ±0.1% 0.05W, 1/20W Chip Resistor 0201 (0603 Metric) Automotive AEC-Q200 Thin Film; ComponentLink1Description: New link; ComponentLink1URL: https://www.digikey.com.au/en/products/detail/panasonic-electronic-components/ERA-1AEB201C/5035575
R5 R7 = ERJ-1GNF2491C: 2.49 kOhms ±1% 0.05W, 1/20W Chip Resistor 0201 (0603 Metric) Thick Film; ComponentLink1Description: New link; ComponentLink1URL: https://www.digikey.com.au/en/products/detail/panasonic-electronic-components/ERJ-1GNF2491C/2036155
U1 = STM32MP257FAK3: Integrated Circuit; Manufacturer_Name: STMicroelectronics; Datasheet Link: https://www.digikey.ph/en/products/detail/stmicroelectronics/STM32MP257FAK3/24883094; Height: 1mm; Manufacturer_Part_Number: STM32MP257FAK3; Mouser Part Number: 511-STM32MP257FAK3; Mouser Price/Stock: https://www.mouser.co.uk/ProductDetail/STMicroelectronics/STM32MP257FAK3?qs=i8QVZAFTkqQulHX8Hxkfng%3D%3D; Arrow Part Number: STM32MP257FAK3; Arrow Price/Stock: https://www.arrow.com/en/products/stm32mp257fak3/stmicroelectronics?utm_currency=USD&region=nac; Supplier 1: Arrow Electronics; Supplier Part Number 1: STM32MP257FAK3
Y1 = CM9V-T1A-32.768KHZ-12.5PF-20PPM-TA-QC: 32.768 kHz ±20ppm Crystal 12.5pF 75 kOhms 2-SMD, No Lead; Supplier 1: Digikey; Supplier Part Number 1: 2195-CM9V-T1A-32.768KHZ-12.5PF-20PPM-TA-QCCT-ND
Y2 = FW400WFMT1: 40 MHz ±7ppm Crystal 12pF 80 Ohms 4-SMD, No Lead
R6 = ERJ-1GNF2400C: ComponentLink1Description: New link; ComponentLink1URL: https://www.digikey.com.au/en/products/detail/panasonic-electronic-components/ERJ-1GNF2400C/2036039